# EAGLE schematic PCB_KioskMB_r3.2 (EAGLE 8.2.1)
Assembly variants: 12V_STRIKE, 24V_STRIKE

## Sheet 1 of 7
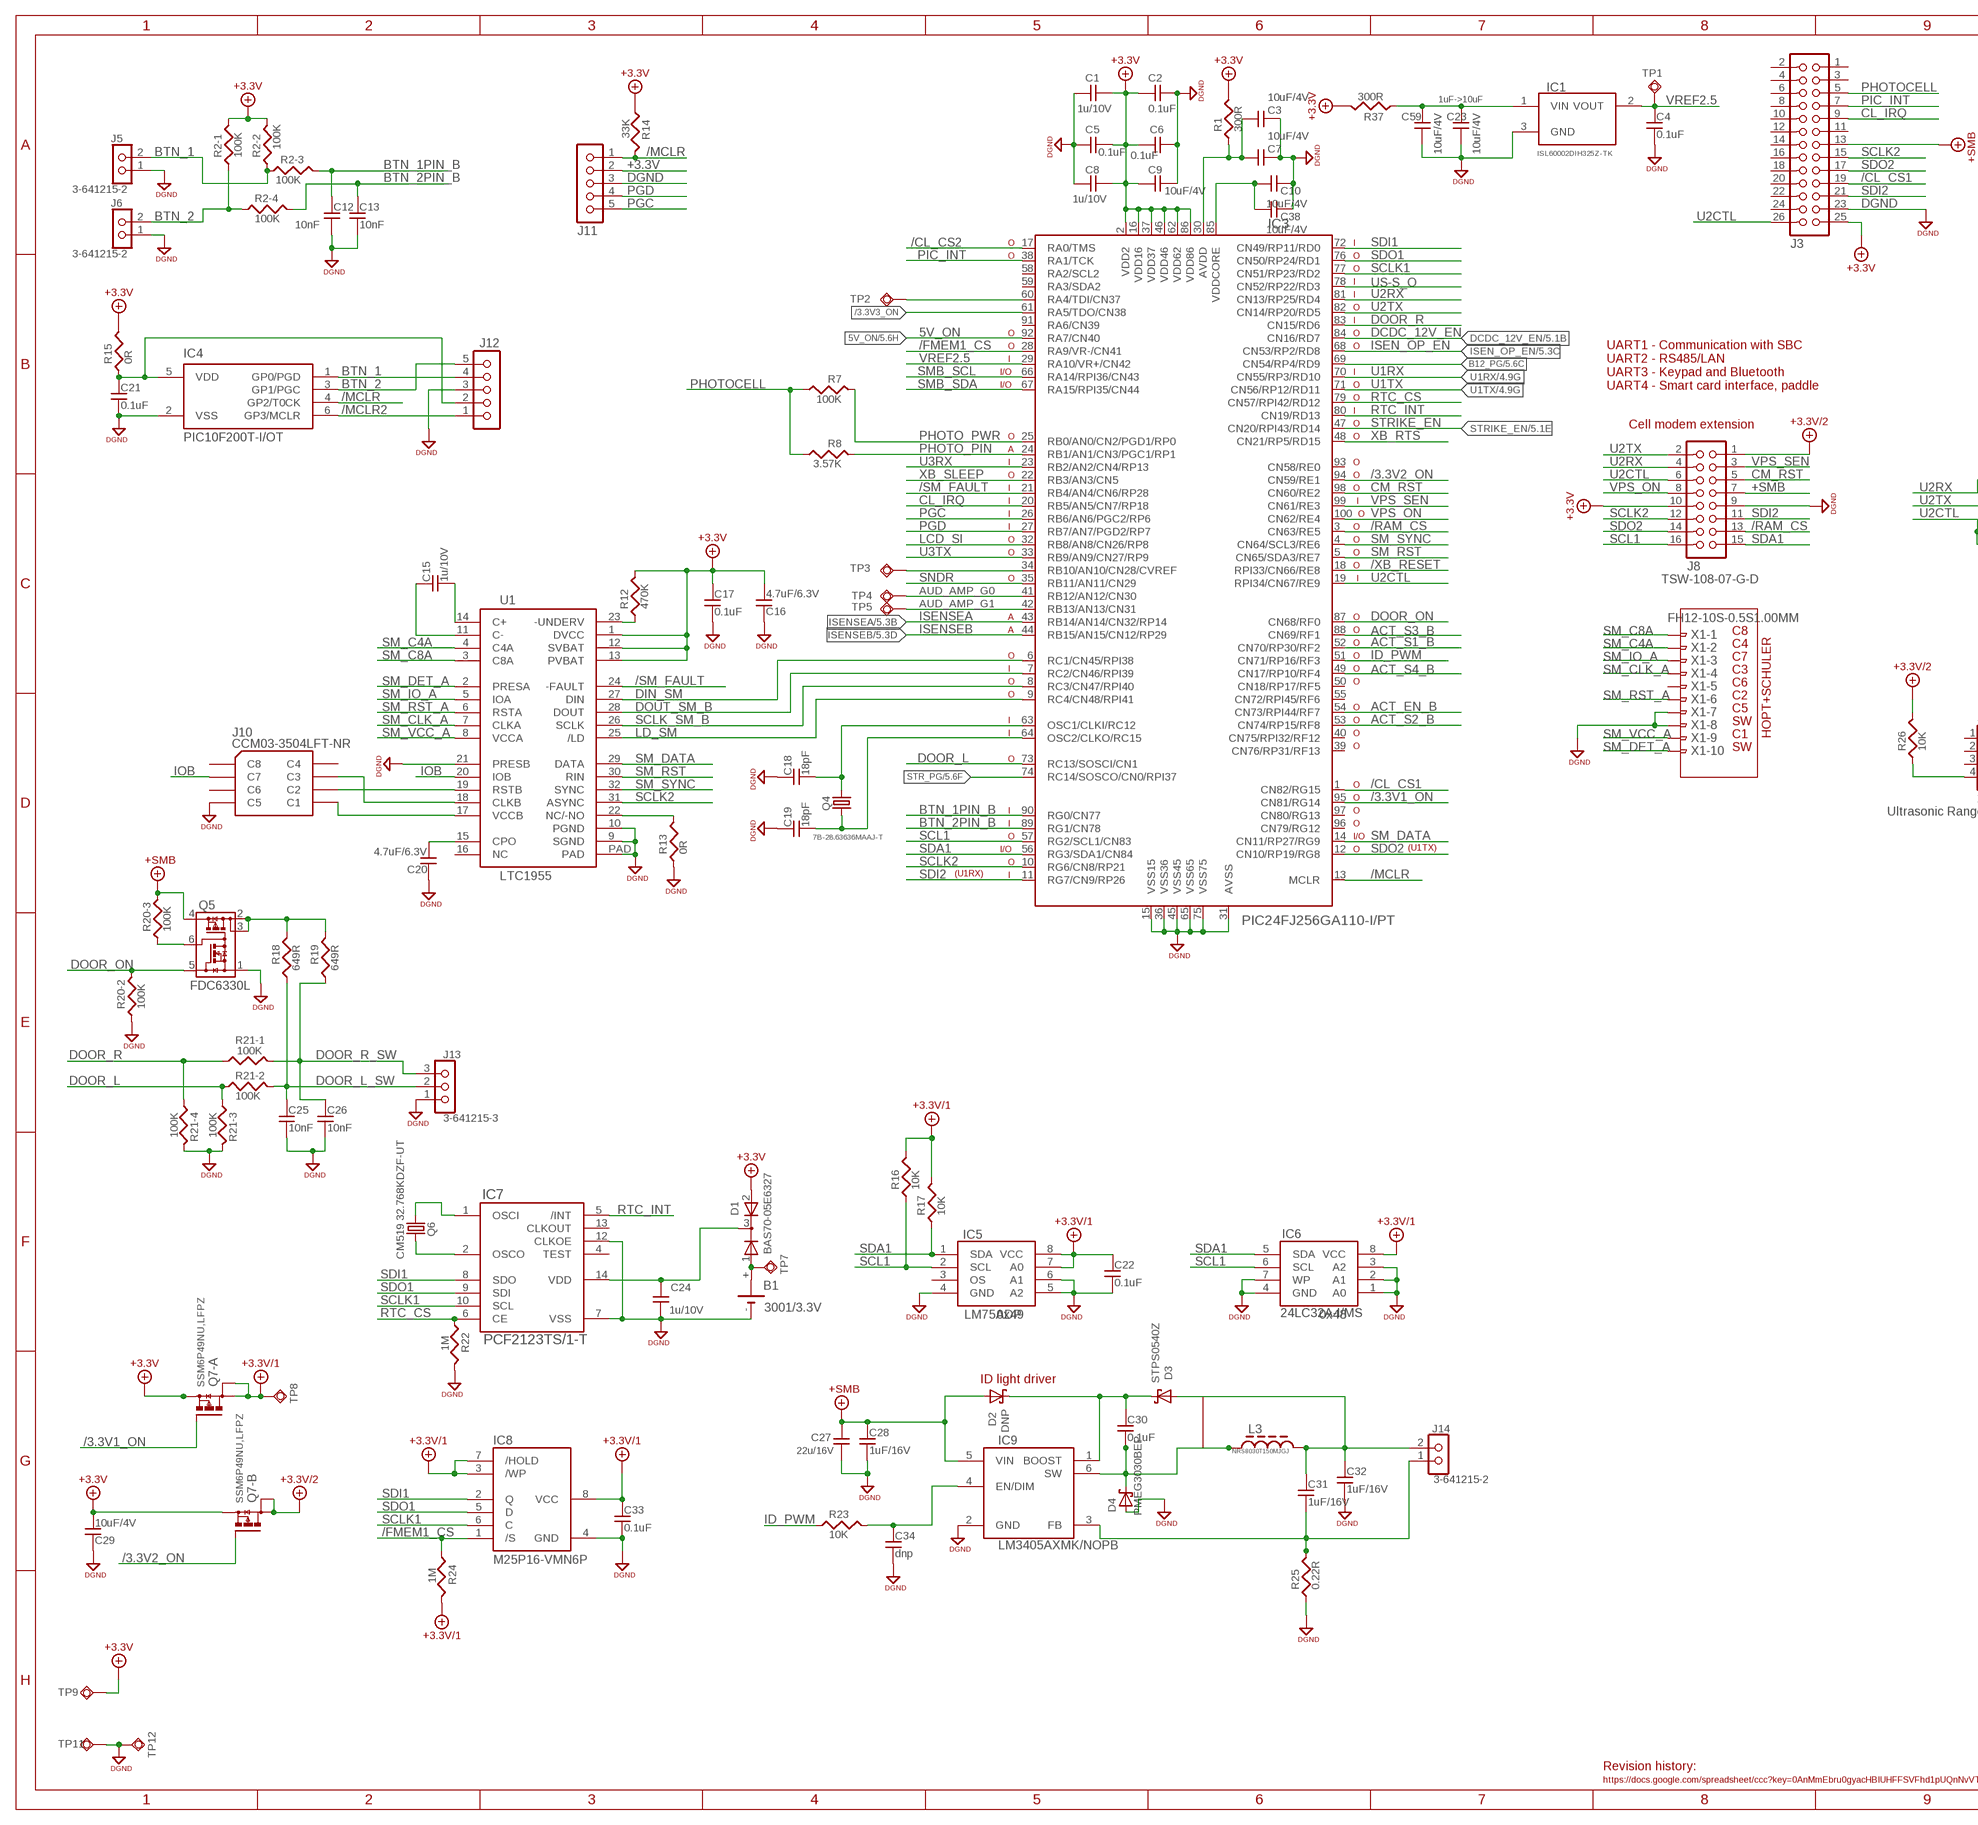
[diagram p0: schematic, sheet 1, part 1 of 2]
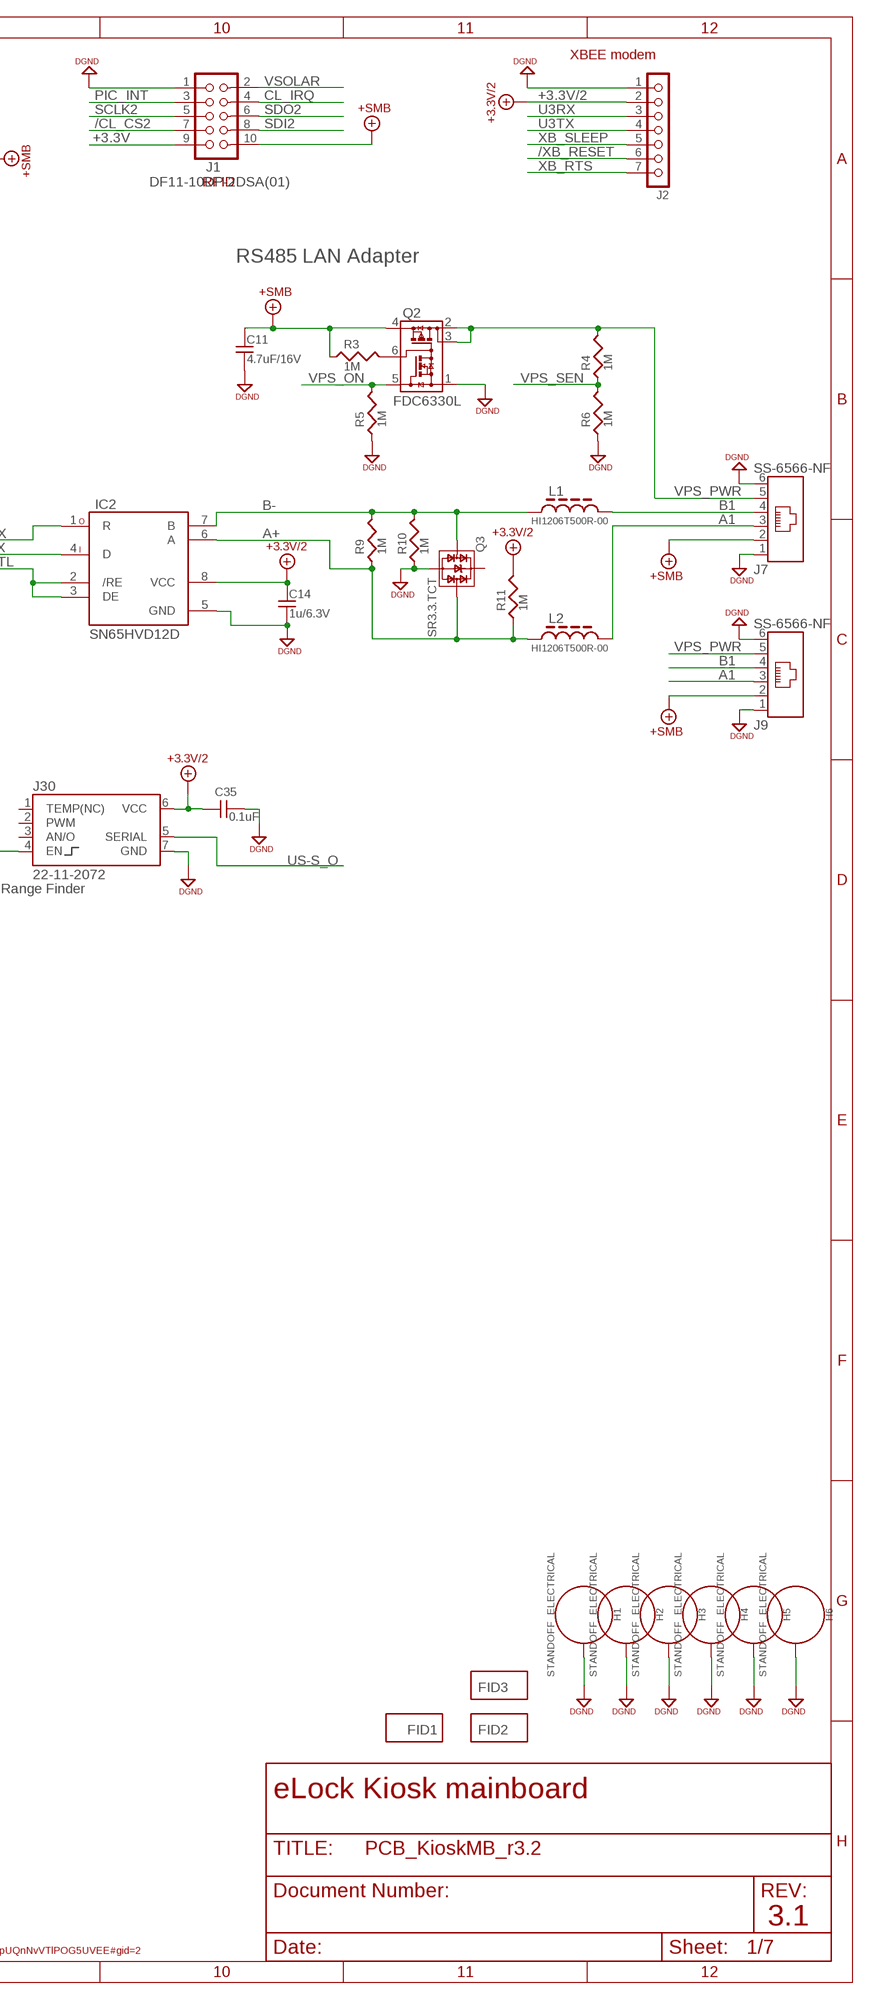
[diagram p1: schematic, sheet 1, part 2 of 2]

### Parts
B1  3001/3.3V  3001  [3001]
C1  1u/10V  C-0603  [0603]
C2  0.1uF  C-0603  [0603]
C3  10uF/4V  C-0603  [0603]
C4  0.1uF  C-0603  [0603]
C5  0.1uF  C-0603  [0603]
C6  0.1uF  C-0603  [0603]
C7  10uF/4V  C-0603  [0603]
C8  1u/10V  C-0603  [0603]
C9  10uF/4V  C-0603  [0603]
C10  10uF/4V  C-0603  [0603]
C11  4.7uF/16V  C-0805  [0805]
C12  10nF  C-0603  [0603]
C13  10nF  C-0603  [0603]
C14  1u/6.3V  C-0603  [0603]
C15  1u/10V  C-0603  [0603]
C16  4.7uF/6.3V  C-0603  [0603]
C17  0.1uF  C-0603  [0603]
C18  18pF  C-0603  [0603]
C19  18pF  C-0603  [0603]
C20  4.7uF/6.3V  C-0603  [0603]
C21  0.1uF  C-0603  [0603]
C22  0.1uF  C-0603  [0603]
C23  10uF/4V  C-0603  [0603]
C24  1u/10V  C-0603  [0603]
C25  10nF  C-0603  [0603]
C26  10nF  C-0603  [0603]
C27  22u/16V  C-1210  [1210]
C28  1uF/16V  C-0603  [0603]
C29  10uF/4V  C-0603  [0603]
C30  0.1uF  C-0603  [0603]
C31  1uF/16V  C-0603  [0603]
C32  1uF/16V  C-0603  [0603]
C33  0.1uF  C-0603  [0603]
C34  dnp  C-0603  [0603]
C35  0.1uF  C-0603  [0603]
C38  10uF/4V  C-0603  [0603]
C59  10uF/4V  C-0603  [0603]
D1  BAS70-05E6327  [SOT-23]
D2  DNP  STPS0540Z  [SOD-123]
D3  STPS0540Z  [SOD-123]
D4  PMEG3030BEP  [SOD-128]
FID1  REF  [REF]
FID2  REF  [REF]
FID3  REF  [REF]
H1  STANDOFF_ELECTRICAL  [STANDOFF-ELECTRICAL]
H2  STANDOFF_ELECTRICAL  [STANDOFF-ELECTRICAL]
H3  STANDOFF_ELECTRICAL  [STANDOFF-ELECTRICAL]
H4  STANDOFF_ELECTRICAL  [STANDOFF-ELECTRICAL]
H5  STANDOFF_ELECTRICAL  [STANDOFF-ELECTRICAL]
H6  STANDOFF_ELECTRICAL  [STANDOFF-ELECTRICAL]
IC1  ISL60002DIH325Z-TK  [SOT-23]
IC2  SN65HVD12D  SN65HVD3082ED  [SO08]
IC3  PIC24FJ256GA110-I/PT  [SQFP-S-12X12-100]
IC4  PIC10F200T-I/OT  [SOT23-6]
IC5  LM75ADP  [TSSOP08-3]
IC6  24LC32A-I/MS  24-I/MS  [MSOP-08]
IC7  PCF2123TS/1-T  [TSSOP014]
IC8  M25P16-VMN6P  [SO-08]
IC9  LM3405AXMK/NOPB  [SOT23-6]
J1  DF11-10DP-2DSA(01)  [DF11-10DP-2DSA]
J2  MA07-1  [MA07-1]
J3  MA13-2  [MA13-2]
J5  3-641215-2  [3-641215-2]
J6  3-641215-2  [3-641215-2]
J7  SS-6566-NF  [SS-6566-NF]
J8  TSW-108-07-G-D  MA08-2  [MA08-2]
J9  SS-6566-NF  [SS-6566-NF]
J10  CCM03-3504LFT-NR  [CCM03-3504LFT-NR]
J11  MA05-1  [MA05-1]
J12  MA05-1  [MA05-1]
J13  3-641215-3  [3-641215-3]
J14  3-641215-2  [3-641215-2]
J30  22-11-2072  HRXL-MAXSONAR-WRC-MB7387  [HRXL-MAXSONAR-WRC-MB7387]
L1  HI1206T500R-00  L-1206  [1206]
L2  HI1206T500R-00  L-1206  [1206]
L3  NRS8030T150MJGJ  [NRS8030]
Q2  FDC6330L  [SSOT-6]
Q3  SR3.3.TCT  SR05.TCT  [SOT-143]
Q4  7B-28.63636MAAJ-T  7B-27.120MAAJ-T  [7B]
Q5  FDC6330L  FDC6324L  [SSOT-6]
Q6  CM519 32.768KDZF-UT  CM519  [CM519]
Q7  SSM6P49NU,LFPZ  [MICRO_FET]
R1  300R  R-0603  [0603]
R2  100K  EXB-38  [0603-ARRAY]
R3  1M  R-0603  [0603]
R4  1M  R-0603  [0603]
R5  1M  R-0603  [0603]
R6  1M  R-0603  [0603]
R7  100K  R-0603  [0603]
R8  3.57K  R-0603  [0603]
R9  1M  R-0603  [0603]
R10  1M  R-0603  [0603]
R11  1M  R-0603  [0603]
R12  470K  R-0603-0RTOP  [0603-0RTOP]
R13  0R  R-0603-0RTOP  [0603-0RTOP]
R14  33K  R-0603  [0603]
R15  0R  R-0603-0RTOP  [0603-0RTOP]
R16  10K  R-0603-0RTOP  [0603-0RTOP]
R17  10K  R-0603-0RTOP  [0603-0RTOP]
R18  649R  R-0603  [0603]
R19  649R  R-0603  [0603]
R20  100K  EXB-38  [0603-ARRAY]
R21  100K  EXB-38  [0603-ARRAY]
R22  1M  R-0603  [0603]
R23  10K  R-0603-0RTOP  [0603-0RTOP]
R24  1M  R-0603  [0603]
R25  0.22R  R-0603-0RTOP  [0603-0RTOP]
R26  10K  R-0603-0RTOP  [0603-0RTOP]
R37  300R  R-0603  [0603]
TP1  ROUND_SMD1MM  [SMD_ROUND_1MM]
TP2  ROUND_SMD1MM  [SMD_ROUND_1MM]
TP3  ROUND_SMD1MM  [SMD_ROUND_1MM]
TP4  ROUND_SMD1MM  [SMD_ROUND_1MM]
TP5  ROUND_SMD1MM  [SMD_ROUND_1MM]
TP7  ROUND_SMD1MM  [SMD_ROUND_1MM]
TP8  ROUND_SMD1MM  [SMD_ROUND_1MM]
TP9  ROUND_SMD0.7MM  [SMD_ROUND_07MM]
TP11  ROUND_SMD0.7MM  [SMD_ROUND_07MM]
TP12  TP_0812  [TP_0.8_1.2]
U1  LTC1955  [LFCSP_5X5_032]
X1  FH12-10S-0.5S1.00MM  [CON-FPC-1.0MM-10POS]

### Nets
5V_ON: IC3.92(RA7/CN40) ; also sheet 5
+3.3V: C1.1 C2.1 C5.1 C6.1 C8.1 C9.1 C16.2 C17.1 C29.2 D1.2(A2) IC3.2(VDD2) IC3.16(VDD16) IC3.37(VDD37) IC3.46(VDD46) IC3.62(VDD62) IC3.86(VDD86) J1.9 J3.25 J8.10 J11.2 Q7.1(-A:S) Q7.4(-B:S) R1.2 R2.7 R2.8 R12.2 R14.2 R15.2 R37.2 TP9.P$1(TP) U1.1(DVCC) U1.12(SVBAT) U1.13(PVBAT) ; also sheet 5
+3.3V/1: C22.1 C33.1 IC5.7(A0) IC5.8(VCC) IC6.8(VCC) IC8.3(/WP) IC8.7(/HOLD) IC8.8(VCC) Q7.6(-A:D) Q7.P1(-A:D1) R16.2 R17.2 R24.1 TP8.P$1(TP) ; also sheet 2,6
+3.3V/2: C14.1 C35.2 IC2.8(VCC) J2.2 J8.1 J30.6(VCC) Q7.3(-B:D) Q7.P2(-B:D1) R11.2 R26.2
+SMB: C11.1 C27.1 C28.1 D2.A IC9.5(VIN) J1.10 J3.13 J7.2 J8.7 J9.2 Q2.4(Q2S) Q5.4(Q2S) R3.1 R20.6 ; also sheet 5
/3.3V1_ON: IC3.95(CN81/RG14) Q7.2(-A:G)
/3.3V2_ON: IC3.94(CN59/RE1) Q7.5(-B:G)
/3.3V3_ON: IC3.61(RA5/TDO/CN38)
/CL_CS1: IC3.1(CN82/RG15) J3.19
/CL_CS2: IC3.17(RA0/TMS) J1.7
/FMEM1_CS: IC3.28(RA9/VR-/CN41) IC8.1(/S) R24.2
/MCLR: IC3.13(MCLR) IC4.4(GP2/T0CK) J11.1 R14.1
/MCLR2: IC4.6(GP3/MCLR) J12.1
/RAM_CS: IC3.3(CN63/RE5) J8.13
/SM_FAULT: IC3.21(RB4/AN4/CN6/RP28) U1.24(-FAULT)
/XB_RESET: IC3.18(RPI33/CN66/RE8) J2.6
A1: J7.3 J9.3 L2.2
A+: IC2.6(A) L2.1 Q3.3 R9.1 R11.1
ACT_EN_B: IC3.54(CN73/RPI44/RF7)
ACT_S1_B: IC3.52(CN70/RP30/RF2) ; also sheet 5
ACT_S2_B: IC3.53(CN74/RP15/RF8) ; also sheet 5
ACT_S3_B: IC3.88(CN69/RF1)
ACT_S4_B: IC3.49(CN17/RP10/RF4)
AUD_AMP_G0: IC3.41(RB12/AN12/CN30) TP4.P$1(TP) ; also sheet 6
AUD_AMP_G1: IC3.42(RB13/AN13/CN31) TP5.P$1(TP) ; also sheet 6
B1: J7.4 J9.4 L1.2
B12_PG: IC3.69(CN54/RP4/RD9) ; also sheet 5
B-: IC2.7(B) L1.1 Q3.2 R9.2 R10.2
BTN_1: IC4.1(GP0/PGD) J5.2 J12.4 R2.2 R2.3
BTN_1PIN_B: C12.1 IC3.90(RG0/CN77) R2.6
BTN_2: IC4.3(GP1/PGC) J6.2 J12.5 R2.1 R2.4
BTN_2PIN_B: C13.1 IC3.89(RG1/CN78) R2.5
CL_IRQ: IC3.20(RB5/AN5/CN7/RP18) J1.4 J3.9
CM_RST: IC3.98(CN60/RE2) J8.5
DCDC_12V_EN: IC3.84(CN16/RD7) ; also sheet 5
DGND: B1.- C1.2 C2.2 C3.2 C4.2 C5.2 C6.2 C7.2 C8.2 C9.2 C10.1 C11.2 C12.2 C13.2 C14.2 C16.1 C17.2 C18.1 C19.1 C20.1 C21.2 C22.2 C23.2 C24.2 C25.2 C26.2 C27.2 C28.2 C29.1 C32.2 C33.2 C34.2 C35.1 C38.1 C59.2 D4.A H1.P1 H2.P1 H3.P1 H4.P1 H5.P1 IC1.3(GND) IC2.5(GND) IC3.15(VSS15) IC3.31(AVSS) IC3.36(VSS36) IC3.45(VSS45) IC3.65(VSS65) IC3.75(VSS75) IC4.2(VSS) IC5.4(GND) IC5.5(A2) IC5.6(A1) IC6.1(A0) IC6.2(A1) IC6.3(A2) IC6.4(GND) IC6.7(WP) IC7.7(VSS) IC7.12(CLKOE) IC8.4(GND) IC9.2(GND) J1.1 J2.1 J3.23 J5.1 J6.1 J7.1 J7.6 J8.9 J9.1 J9.6 J10.C5 J11.3 J12.3 J13.1 J30.7(GND) Q2.1(Q1S) Q3.1 Q5.1(Q1S) R5.1 R6.1 R10.1 R13.1 R20.2 R21.5 R21.6 R22.1 R25.1 TP11.P$1(TP) TP12.1(TP) U1.9(SGND) U1.10(PGND) U1.21(PRESB) U1.PAD X1.7 X1.8 ; also sheet 2,4,5,6
DIN_SM: IC3.6(RC1/CN45/RPI38) U1.27(DIN)
DOOR_L: IC3.73(RC13/SOSCI/CN1) R21.2 R21.3
DOOR_L_SW: C25.1 J13.2 R18.2 R21.7
DOOR_ON: IC3.87(CN68/RF0) Q5.5(Q1G) R20.7
DOOR_R: IC3.83(CN15/RD6) R21.1 R21.4
DOOR_R_SW: C26.1 J13.3 R19.2 R21.8
DOUT_SM_B: IC3.7(RC2/CN46/RPI39) U1.28(DOUT)
ID_PWM: IC3.51(CN71/RP16/RF3) R23.1
IOB: J10.C7 U1.20(IOB)
ISEN_OP_EN: IC3.68(CN53/RP2/RD8) ; also sheet 5
ISENSEA: IC3.43(RB14/AN14/CN32/RP14) ; also sheet 5
ISENSEB: IC3.44(RB15/AN15/CN12/RP29) ; also sheet 5
LCD_SI: IC3.32(RB8/AN8/CN26/RP8)
LD_SM: IC3.9(RC4/CN48/RPI41) U1.25(/LD)
N$1: C10.2 C38.2 IC3.85(VDDCORE)
N$2: C20.2 U1.15(CPO)
N$3: B1.+ D1.1(A1) TP7.P$1(TP)
N$7: J10.C2 U1.19(RSTB)
N$8: C19.2 IC3.64(OSC2/CLKO/RC15) Q4.1
N$9: J30.4(EN) R26.1
N$13: C15.1 U1.11(C-)
N$14: C15.2 U1.14(C+)
N$16: C24.1 D1.3(K) IC7.14(VDD)
N$18: R12.1 U1.23(-UNDERV)
N$22: IC7.1(OSCI) Q6.2
N$23: IC7.2(OSCO) Q6.1
N$25: R13.2 U1.22(NC/-NO)
N$28: J10.C3 U1.18(CLKB)
N$34: J10.C1 U1.17(VCCB)
N$35: Q5.6(Q2G) R20.3
N$36: C18.2 IC3.63(OSC1/CLKI/RC12) Q4.3
N$39: C23.1 C59.1 IC1.1(VIN) R37.1
N$40: Q5.2(Q2D1) Q5.3(Q2D2) R18.1 R19.1
N$43: C21.1 IC4.5(VDD) J12.2 R15.1
N$44: IC3.34(RB10/AN10/CN28/CVREF) TP3.P$1(TP)
N$49: C3.1 C7.1 IC3.30(AVDD) R1.1
N$55: IC3.60(RA4/TDI/CN37) TP2.P$1(TP)
N$63: C34.1 IC9.4(EN/DIM) R23.2
N$64: C30.2 D4.K IC9.6(SW) L3.1
N$65: C31.2 IC9.3(FB) J14.1 R25.2
N$66: C30.1 D2.C(K) D3.C(K) IC9.1(BOOST)
N$67: C31.1 C32.1 D3.A J14.2 L3.2
N$99: Q2.6(Q2G) R3.2
PGC: IC3.26(RB6/AN6/PGC2/RP6) J11.5
PGD: IC3.27(RB7/AN7/PGD2/RP7) J11.4
PHOTO_PIN: IC3.24(RB1/AN1/CN3/PGC1/RP1) R8.1
PHOTO_PWR: IC3.25(RB0/AN0/CN2/PGD1/RP0) R7.1
PHOTOCELL: J3.5 R7.2 R8.2
PIC_INT: IC3.38(RA1/TCK) J1.3 J3.7
RTC_CS: IC3.79(CN57/RPI42/RD12) IC7.6(CE) R22.2
RTC_INT: IC3.80(CN19/RD13) IC7.5(/INT)
SCL1: IC3.57(RG2/SCL1/CN83) IC5.2(SCL) IC6.6(SCL) J8.16 R16.1 ; also sheet 2
SCLK1: IC3.77(CN51/RP23/RD2) IC7.10(SCL) IC8.6(C)
SCLK2: IC3.10(RG6/CN8/RP21) J1.5 J3.15 J8.12 U1.31(ASYNC)
SCLK_SM_B: IC3.8(RC3/CN47/RPI40) U1.26(SCLK)
SDA1: IC3.56(RG3/SDA1/CN84) IC5.1(SDA) IC6.5(SDA) J8.15 R17.1 ; also sheet 2
SDI1: IC3.72(CN49/RP11/RD0) IC7.8(SDO) IC8.2(Q)
SDI2: IC3.11(RG7/CN9/RP26) J1.8 J3.21 J8.11
SDO1: IC3.76(CN50/RP24/RD1) IC7.9(SDI) IC8.5(D)
SDO2: IC3.12(CN10/RP19/RG8) J1.6 J3.17 J8.14
SM_C4A: U1.4(C4A) X1.2
SM_C8A: U1.3(C8A) X1.1
SM_CLK_A: U1.7(CLKA) X1.4
SM_DATA: IC3.14(CN11/RP27/RG9) U1.29(DATA)
SM_DET_A: U1.2(PRESA) X1.10
SM_IO_A: U1.5(IOA) X1.3
SM_RST: IC3.5(CN65/SDA3/RE7) U1.30(RIN)
SM_RST_A: U1.6(RSTA) X1.6
SM_SYNC: IC3.4(CN64/SCL3/RE6) U1.32(SYNC)
SM_VCC_A: U1.8(VCCA) X1.9
SMB_SCL: IC3.66(RA14/RPI36/CN43) ; also sheet 5
SMB_SDA: IC3.67(RA15/RPI35/CN44) ; also sheet 5
SNDR: IC3.35(RB11/AN11/CN29)
STR_PG: IC3.74(RC14/SOSCO/CN0/RPI37) ; also sheet 5
STRIKE_EN: IC3.47(CN20/RPI43/RD14) ; also sheet 5
U1RX: IC3.70(CN55/RP3/RD10) ; also sheet 4
U1TX: IC3.71(CN56/RP12/RD11) ; also sheet 4
U2CTL: IC2.2(/RE) IC2.3(DE) IC3.19(RPI34/CN67/RE9) J3.26 J8.6
U2RX: IC2.1(R) IC3.81(CN13/RP25/RD4) J8.4
U2TX: IC2.4(D) IC3.82(CN14/RP20/RD5) J8.2
U3RX: IC3.23(RB2/AN2/CN4/RP13) J2.3
U3TX: IC3.33(RB9/AN9/CN27/RP9) J2.4
US-S_O: IC3.78(CN52/RP22/RD3) J30.5(SERIAL)
VPS_ON: IC3.100(CN62/RE4) J8.8 Q2.5(Q1G) R5.2
VPS_PWR: J7.5 J9.5 Q2.2(Q2D1) Q2.3(Q2D2) R4.2
VPS_SEN: IC3.99(CN61/RE3) J8.3 R4.1 R6.2
VREF2.5: C4.1 IC1.2(VOUT) IC3.29(RA10/VR+/CN42) TP1.P$1(TP)
VSOLAR: J1.2
XB_RTS: IC3.48(CN21/RP5/RD15) J2.7
XB_SLEEP: IC3.22(RB3/AN3/CN5) J2.5
Unconnected: B1.+2(+) H6.P1 IC3.39(CN76/RP31/RF13) IC3.40(CN75/RPI32/RF12) IC3.50(CN18/RP17/RF5) IC3.55(CN72/RPI45/RF6) IC3.58(RA2/SCL2) IC3.59(RA3/SDA2) IC3.91(RA6/CN39) IC3.93(CN58/RE0) IC3.96(CN79/RG12) IC3.97(CN80/RG13) IC5.3(OS) IC7.4(TEST) IC7.13(CLKOUT) J3.1 J3.2 J3.3 J3.4 J3.6 J3.8 J3.10 J3.11 J3.12 J3.14 J3.16 J3.18 J3.20 J3.22 J3.24 J10.C4 J10.C6 J10.C8 J30.1(TEMP(NC)) J30.2(PWM) J30.3(AN/O) Q3.4 R20.1 R20.4 R20.5 R20.8 U1.16(NC) X1.5

### Notes on the sheet
- XBEE modem
- 1uF->10uF
- RFID
- RS485 LAN Adapter
- O | I
- O | O
- O
- I
- I
- O
- I
- O | O
- O | O
- I
- I/O | I
- I/O | O
- UART1 - Communication with SBC
   UART2 - RS485/LAN 
   UART3 - Keypad and Bluetooth
   UART4 - Smart card interface, paddle
- O
- I
- O | Cell modem extension
- O | O
- A
- I | O
- O | O | O
- I | O
- I | I | I
- I | O
- I | O
- O | O
- O | O
- O
- O | I
- A | O
- A | O | C8
- O | C4
- O | O | C7
- I | O | C3
- O | O | C6
- O | C2
- O | C5
- I | O | SW
- I | O | C1 | HOPT+SCHULER
- O | SW
- O
- O
- O
- I | O | Ultrasonic Range Finder
- I | O
- O | I/O
- I/O | O | (U1TX)
- O
- (U1RX) | I
- 0x49 | 0x48
- ID light driver
- eLock Kiosk mainboard
- 3.1
- Revision history:
- https://docs.google.com/spreadsheet/ccc?key=0AnMmEbru0gyacHBIUHFFSVFhd1pUQnNvVTlPOG5UVEE#gid=2

## Sheet 2 of 7
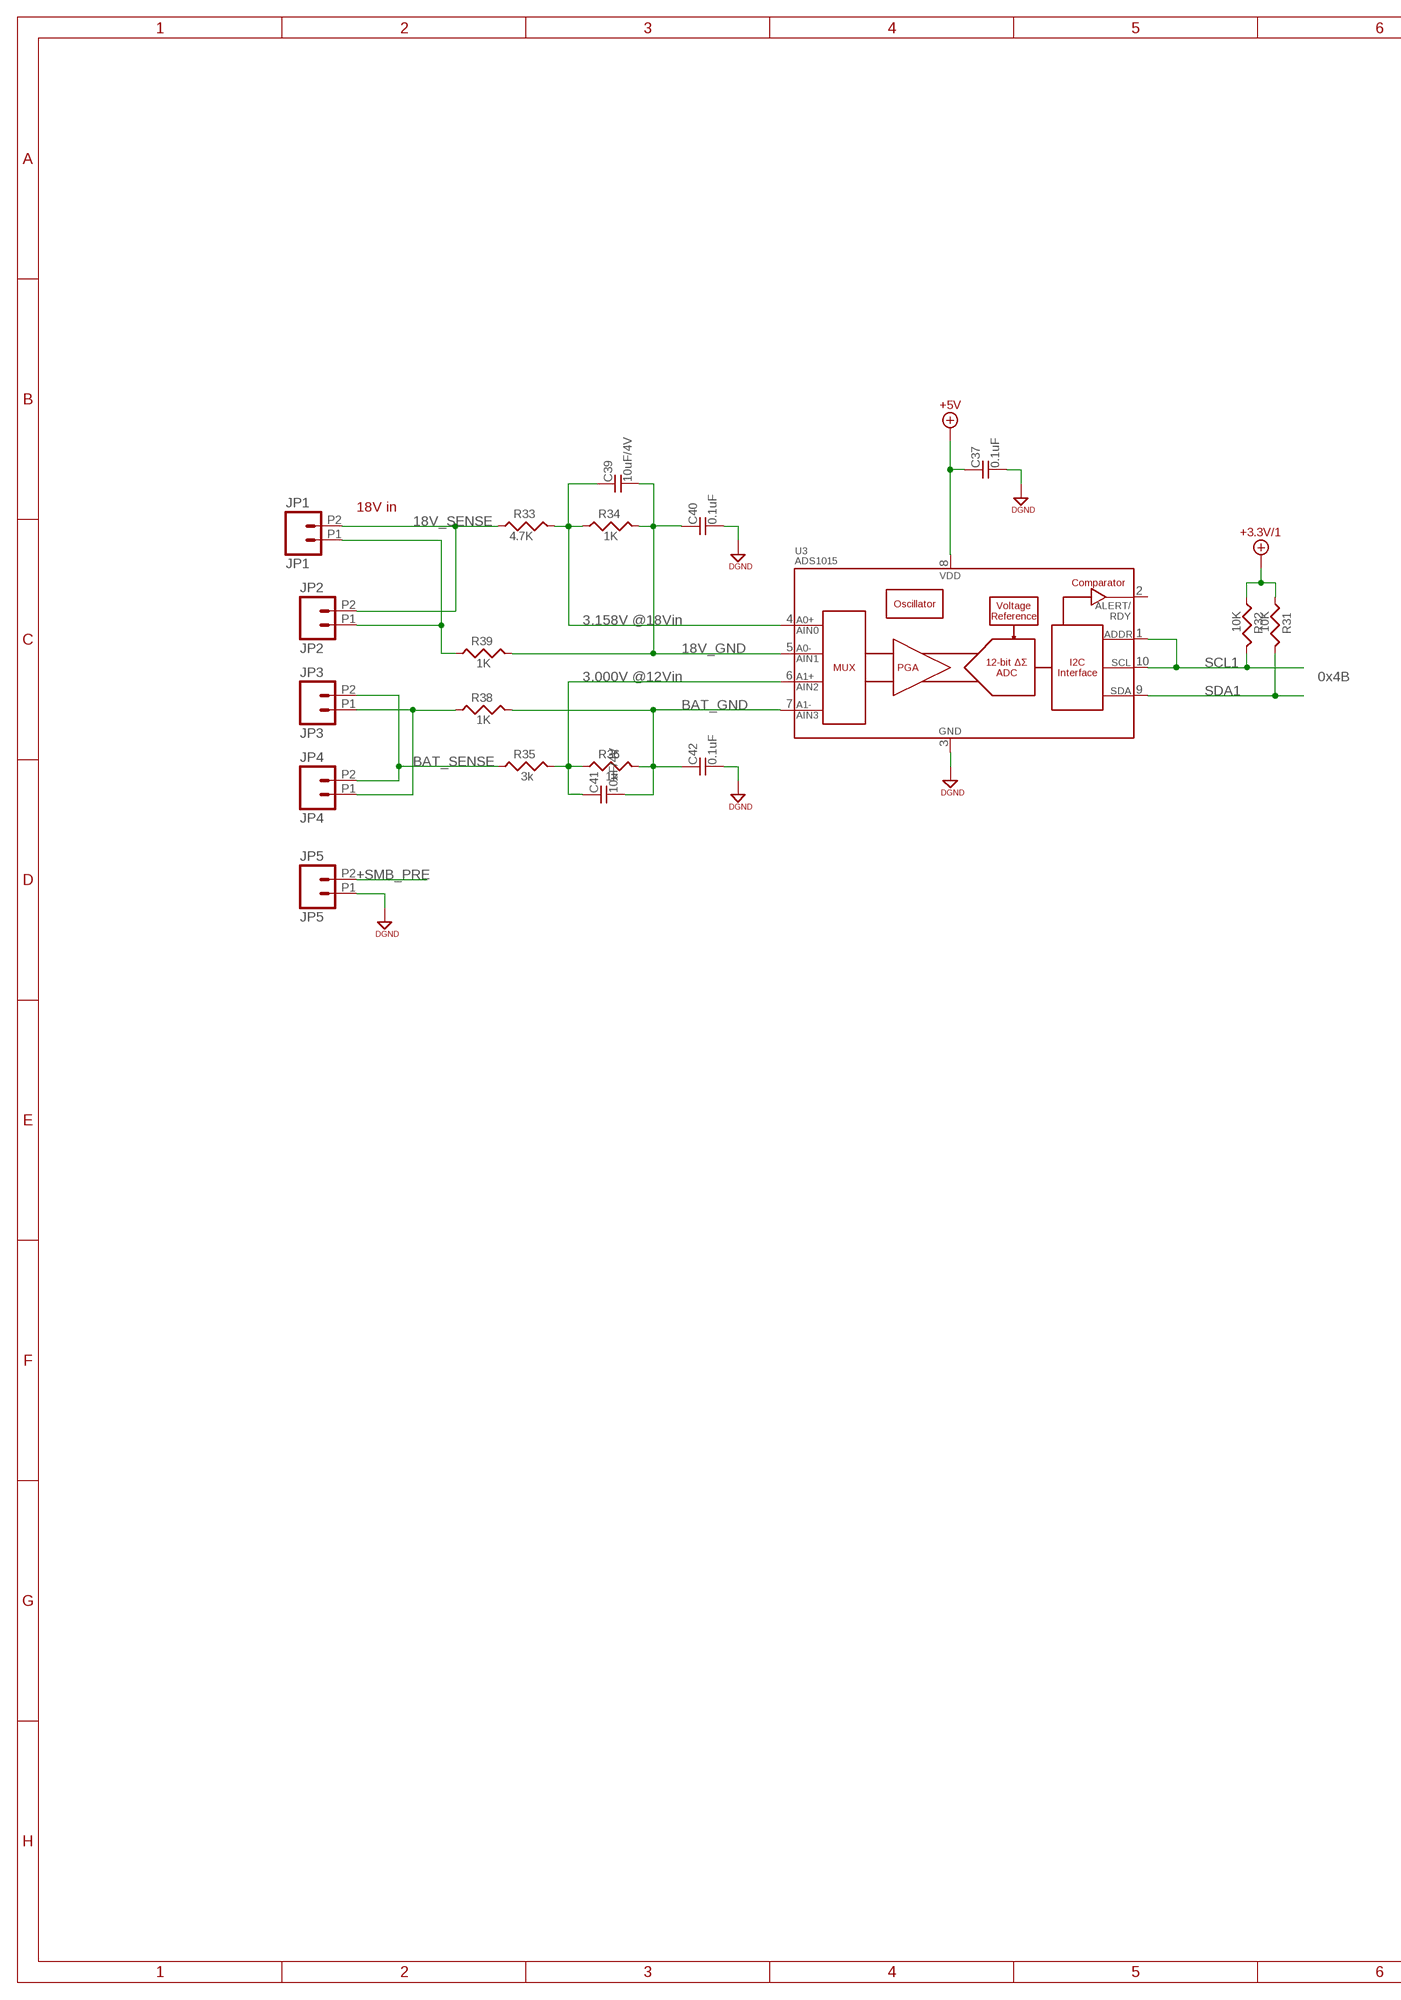
[diagram p2: schematic, sheet 2, part 1 of 2]
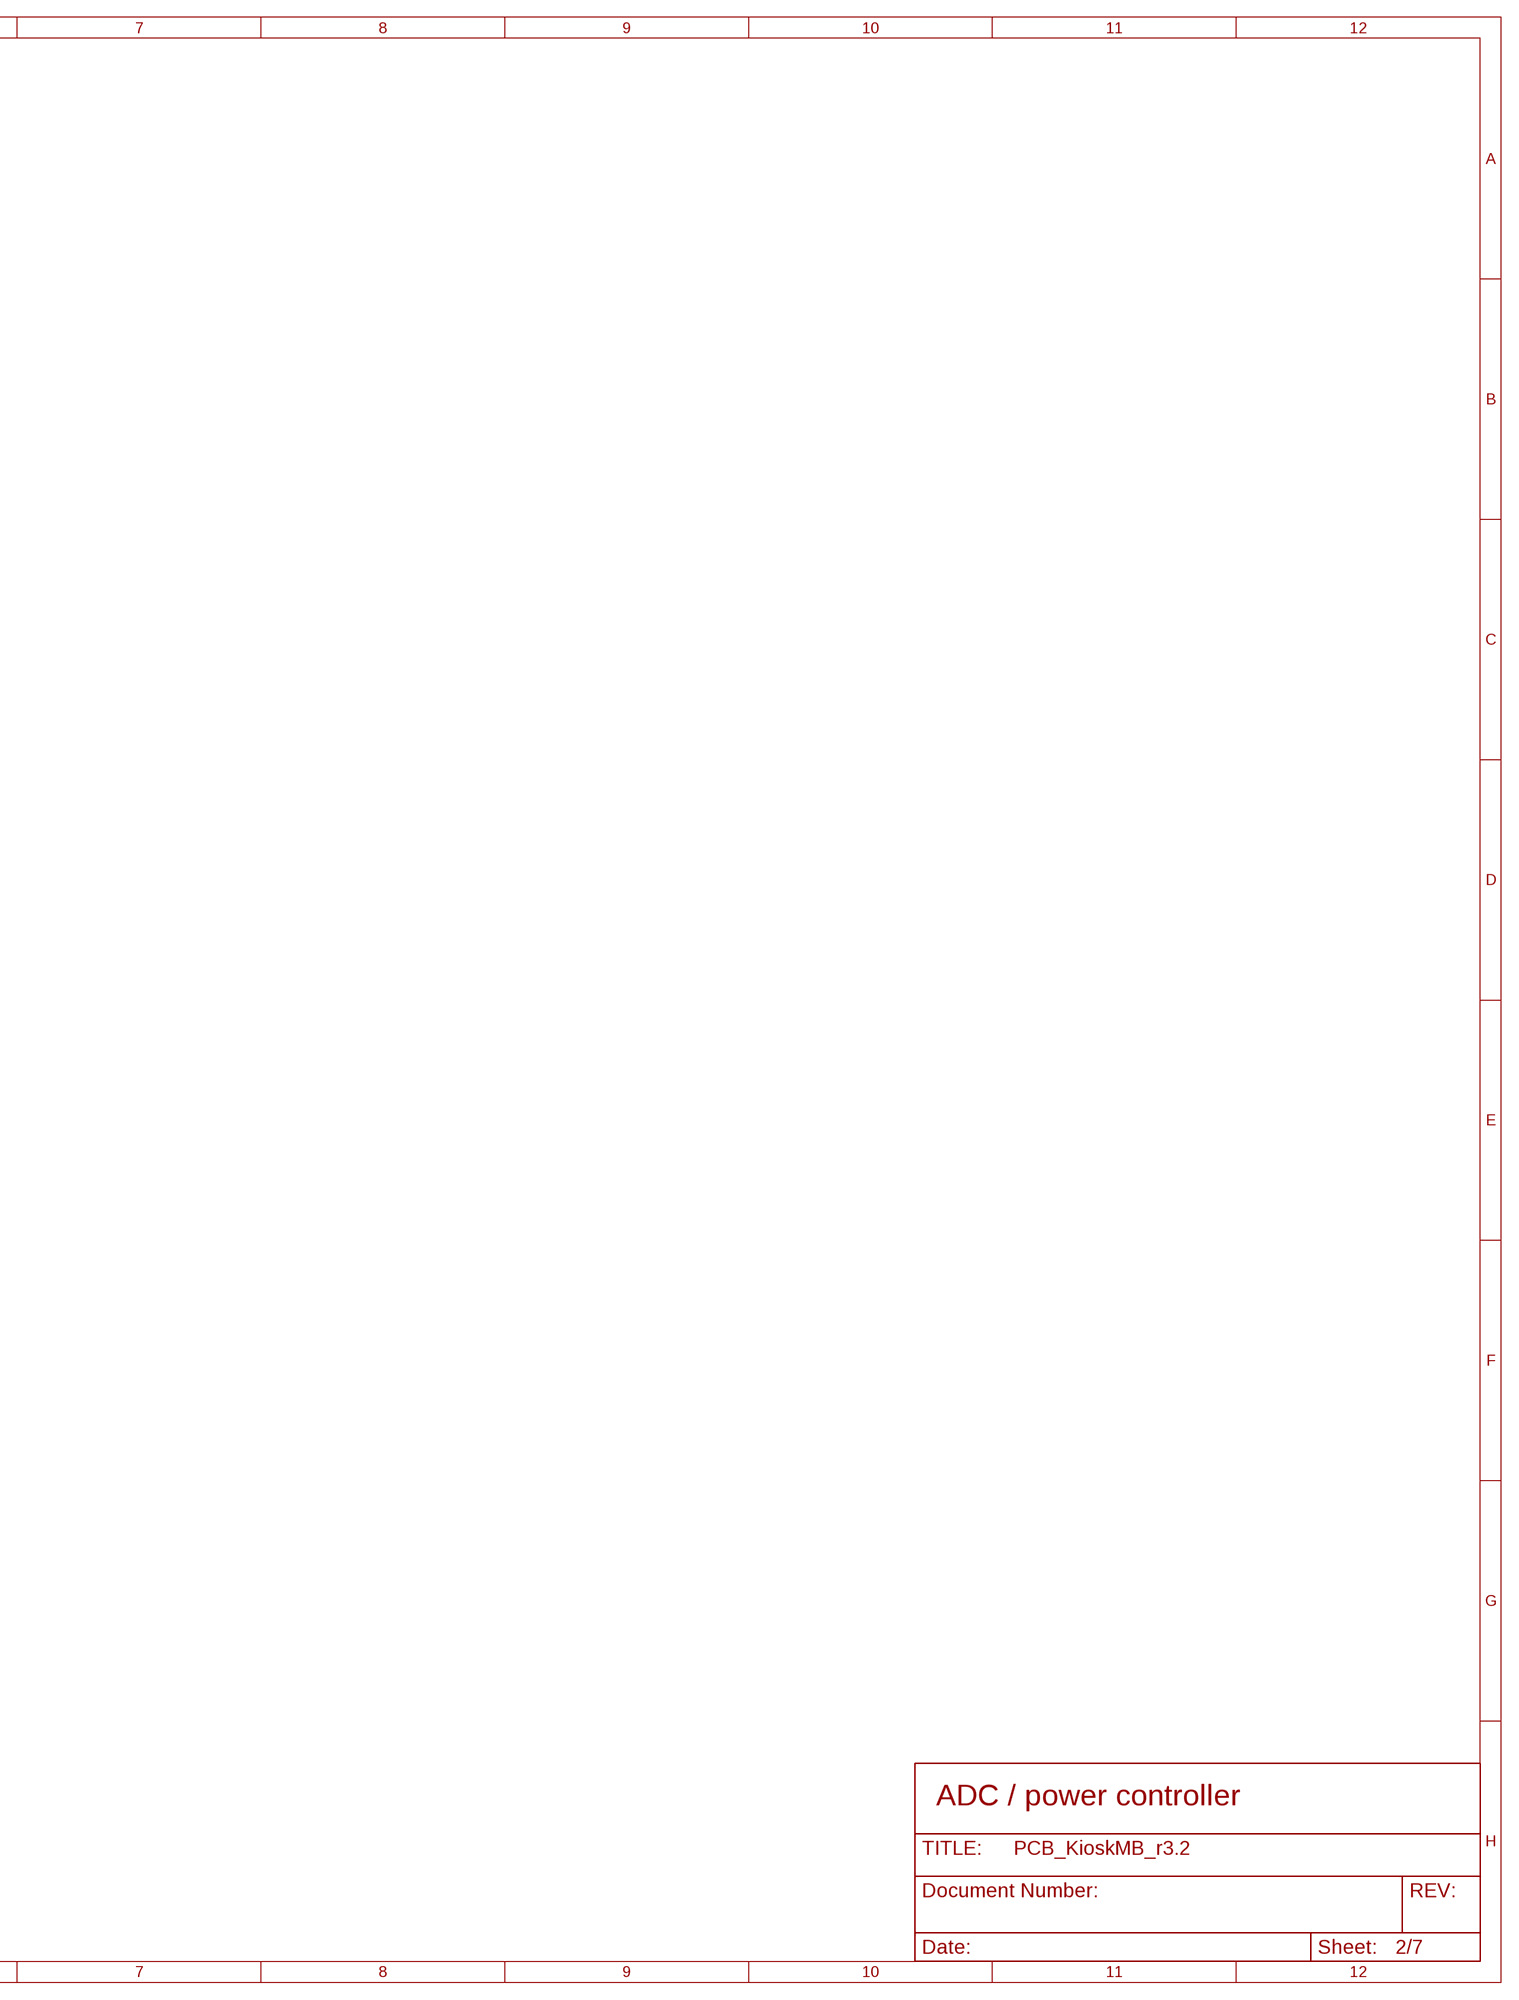
[diagram p3: schematic, sheet 2, part 2 of 2]

### Parts
C37  0.1uF  C-0603  [0603]
C39  10uF/4V  C-0603  [0603]
C40  0.1uF  C-0603  [0603]
C41  10uF/4V  C-0603  [0603]
C42  0.1uF  C-0603  [0603]
JP1  M022.54MM_SCREWTERM  [1X02_2.54_SCREWTERM]
JP2  M022.54MM_SCREWTERM  [1X02_2.54_SCREWTERM]
JP3  M022.54MM_SCREWTERM  [1X02_2.54_SCREWTERM]
JP4  M022.54MM_SCREWTERM  [1X02_2.54_SCREWTERM]
JP5  M022.54MM_SCREWTERM  [1X02_2.54_SCREWTERM]
R31  10K  R-0603  [0603]
R32  10K  R-0603  [0603]
R33  4.7K  R-0603  [0603]
R34  1K  R-0603  [0603]
R35  3k  R-0603  [0603]
R36  1k  R-0603  [0603]
R38  1K  R-0603  [0603]
R39  1K  R-0603  [0603]
U3  ADS1015  [MSOP10]

### Nets
18V_GND: C39.2 C40.1 R34.1 R39.1 U3.5(AIN1)
18V_SENSE: JP1.P2 JP2.P2 R33.2
+3.3V/1: R31.2 R32.2 ; also sheet 1,6
+5V: C37.1 U3.8(VDD) ; also sheet 5
+SMB_PRE: JP5.P2 ; also sheet 5
BAT_GND: C41.2 C42.1 R36.1 R38.1 U3.7(AIN3)
BAT_SENSE: JP3.P2 JP4.P2 R35.2
DGND: C37.2 C40.2 C42.2 JP5.P1 U3.3(VSS) ; also sheet 1,4,5,6
N$5: JP3.P1 JP4.P1 R38.2
N$19: C39.1 R33.1 R34.2 U3.4(AIN0)
N$21: C41.1 R35.1 R36.2 U3.6(AIN2)
N$41: JP1.P1 JP2.P1 R39.2
SCL1: R32.1 U3.1(ADDR) U3.10(SCL) ; also sheet 1
SDA1: R31.1 U3.9(SDA) ; also sheet 1
Unconnected: U3.2(ALERT/RDY)

### Notes on the sheet
- 18V in
- 3.158V @18Vin
- 3.000V @12Vin | 0x4B
- ADC / power controller

## Sheet 3 of 7
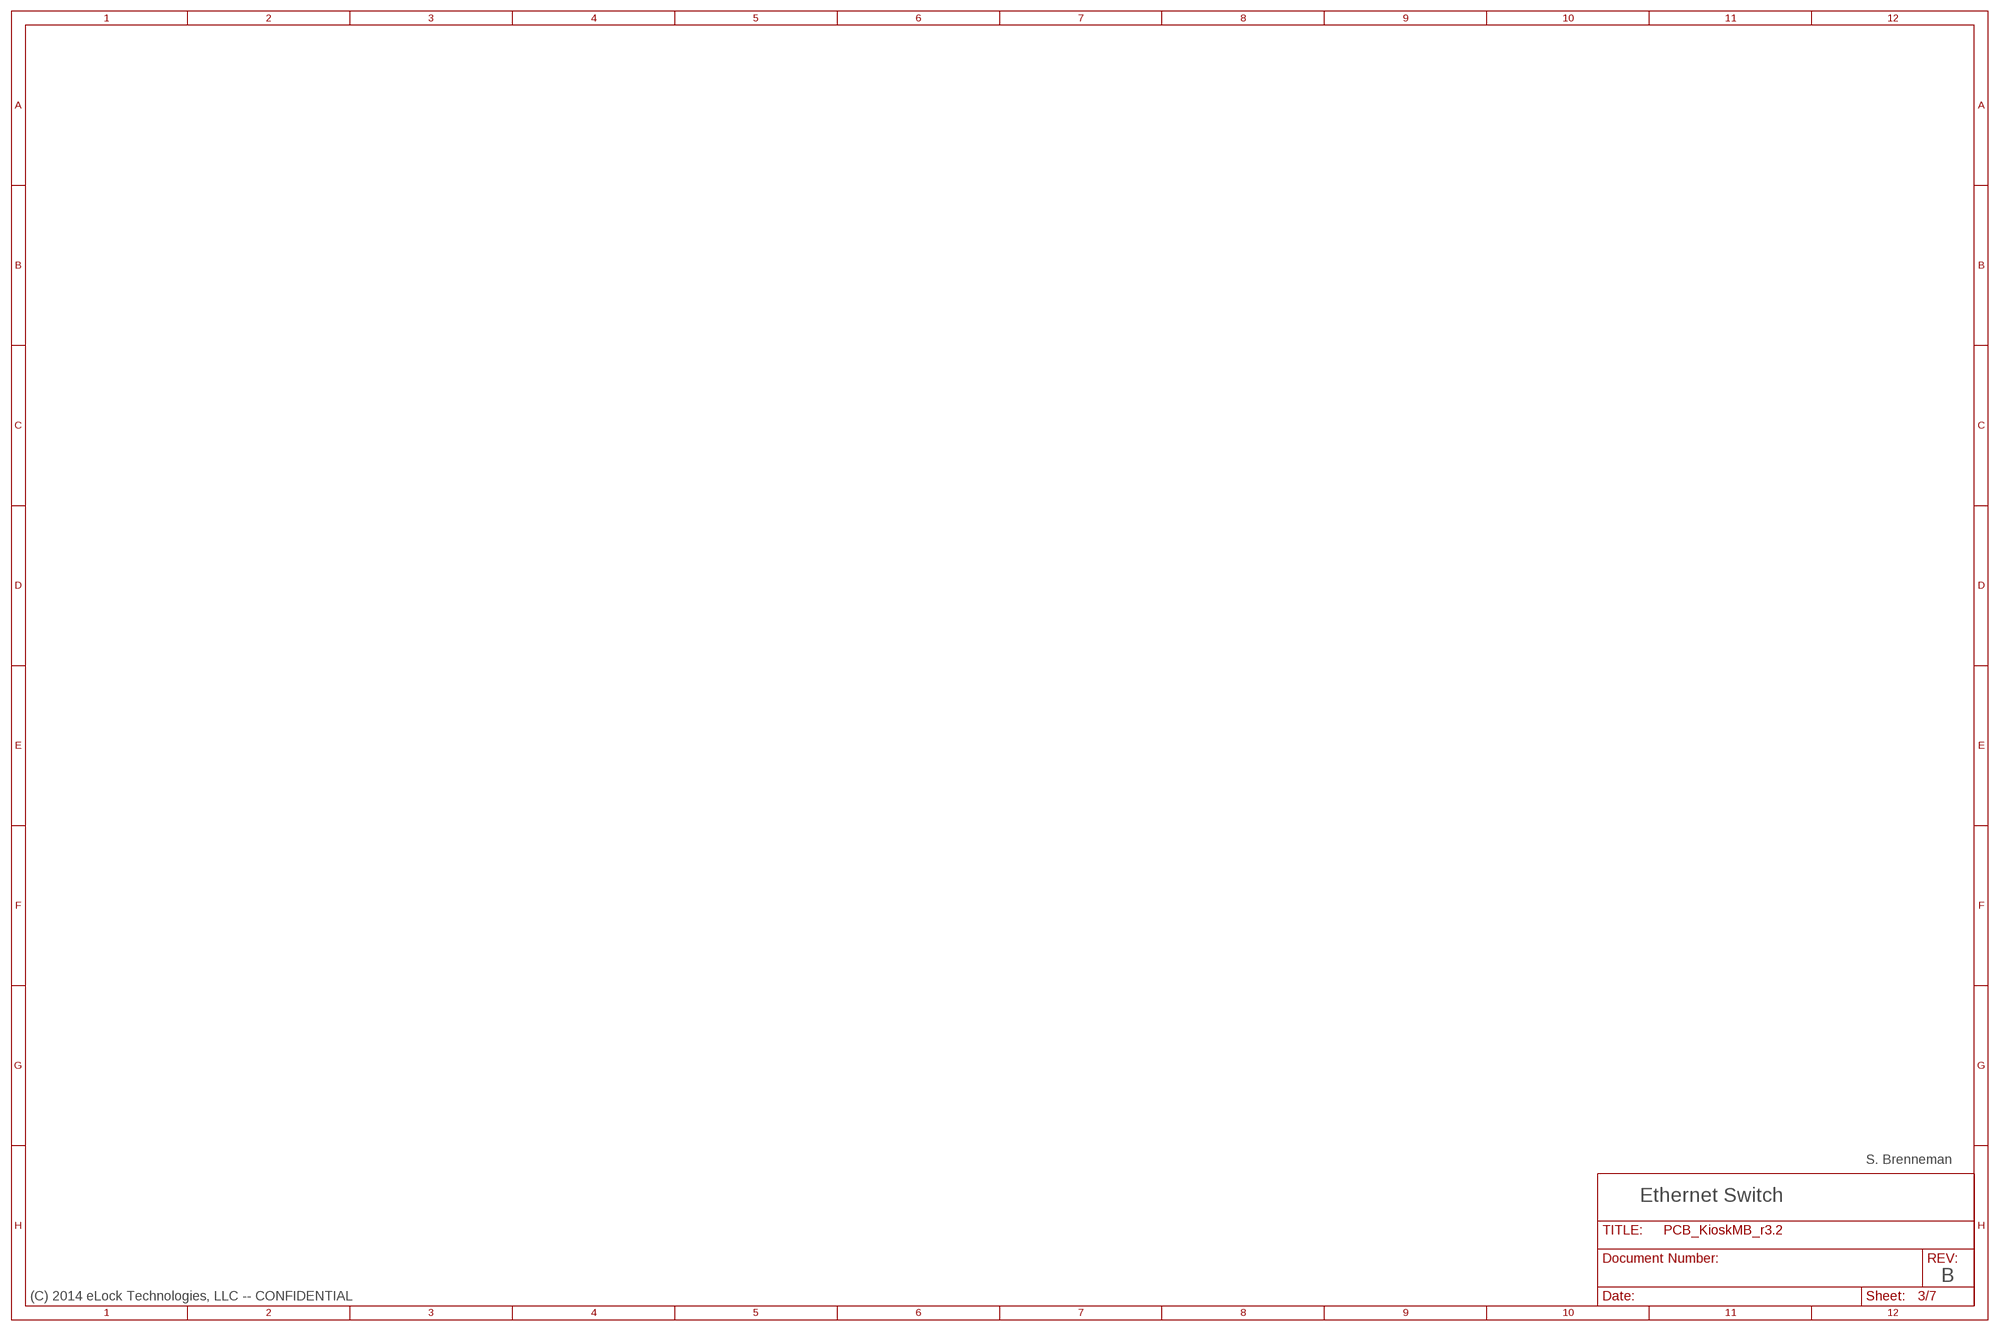
[diagram p4: schematic, sheet 3]

### Notes on the sheet
- S. Brenneman
- Ethernet Switch
- B
- (C) 2014 eLock Technologies, LLC -- CONFIDENTIAL

## Sheet 4 of 7
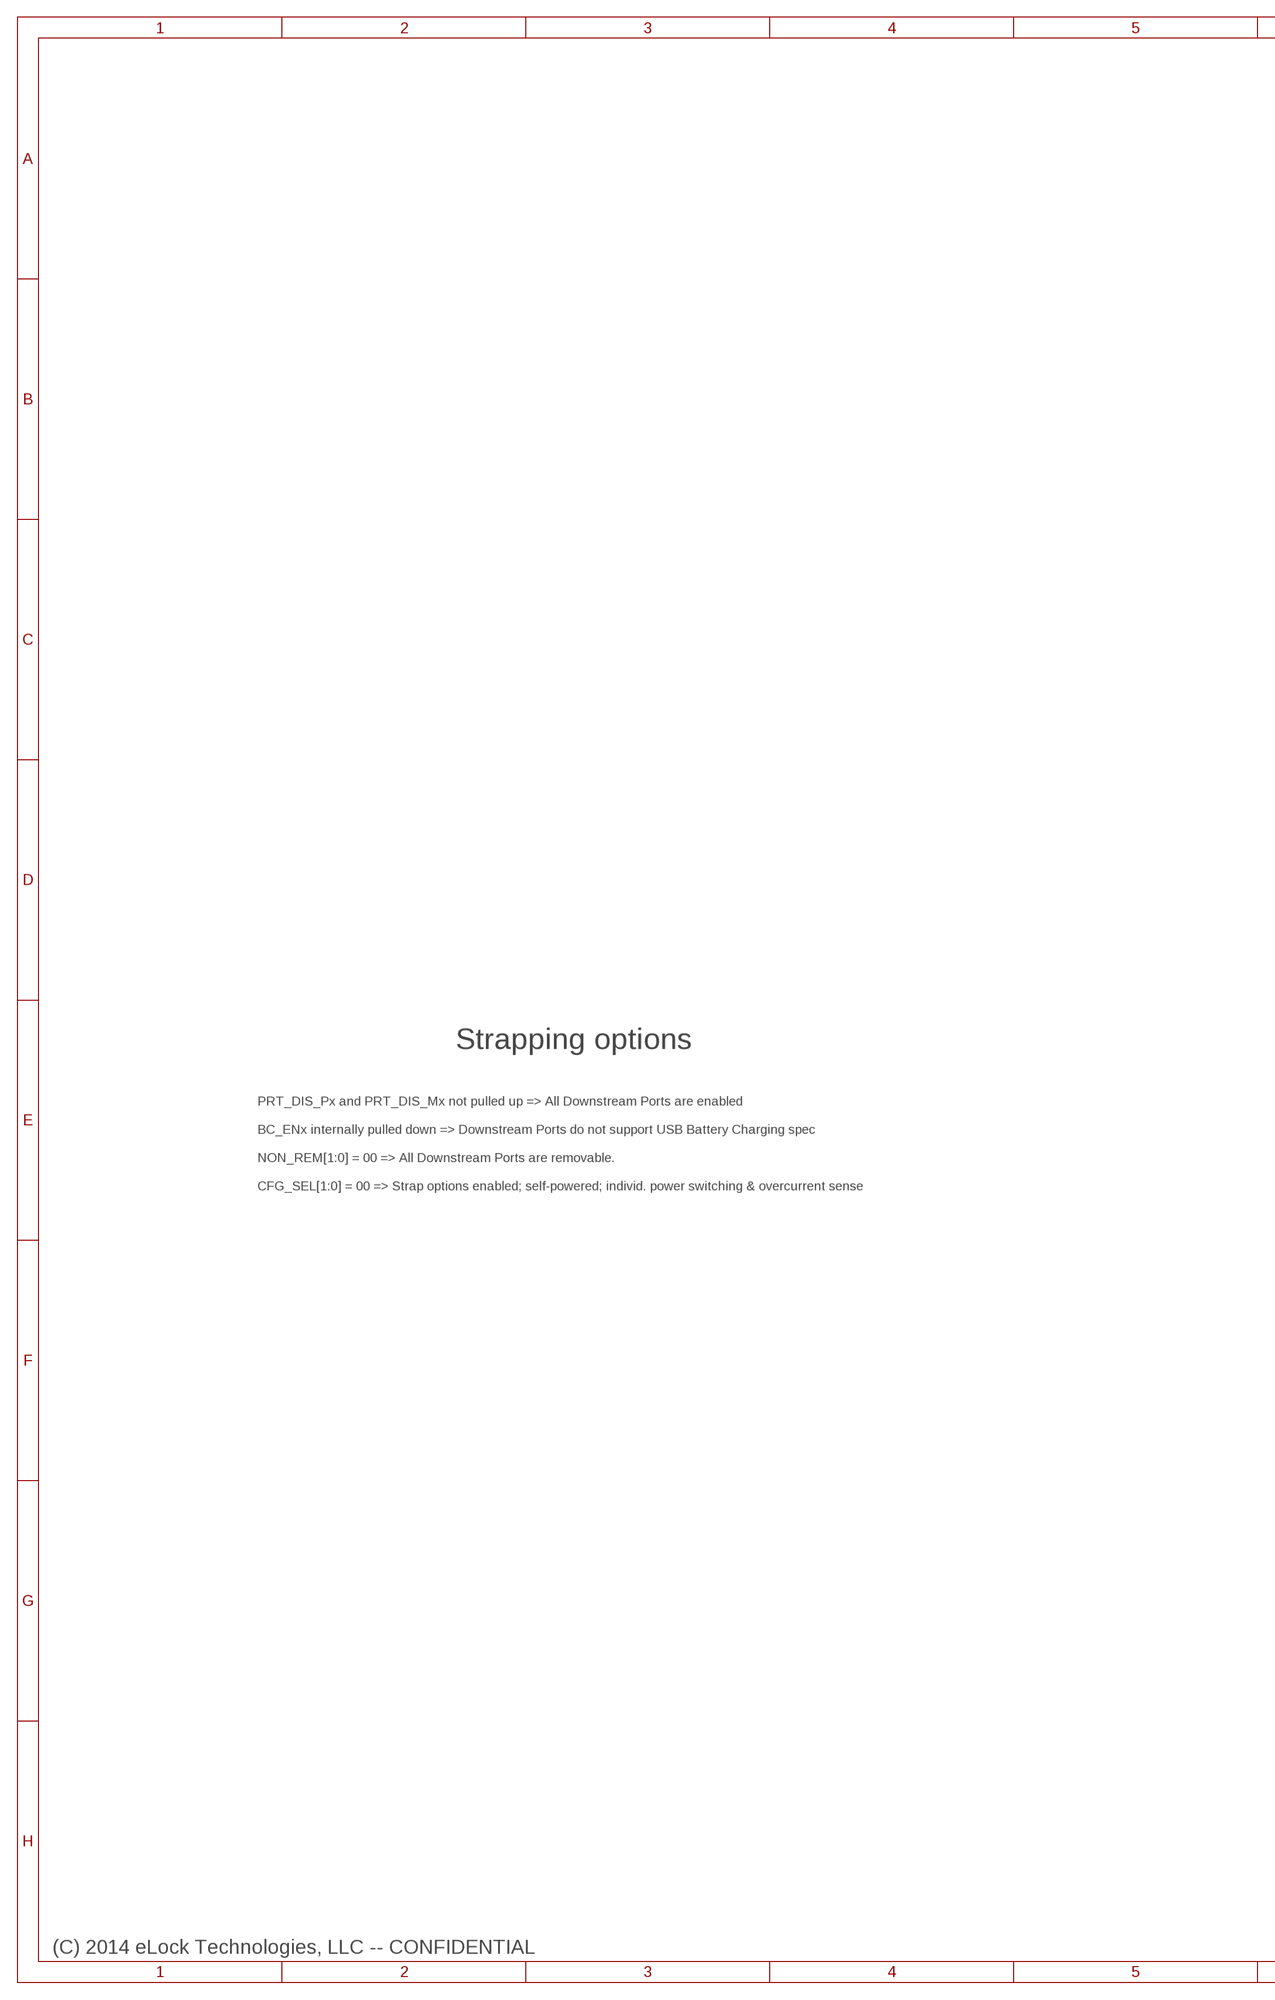
[diagram p5: schematic, sheet 4, part 1 of 2]
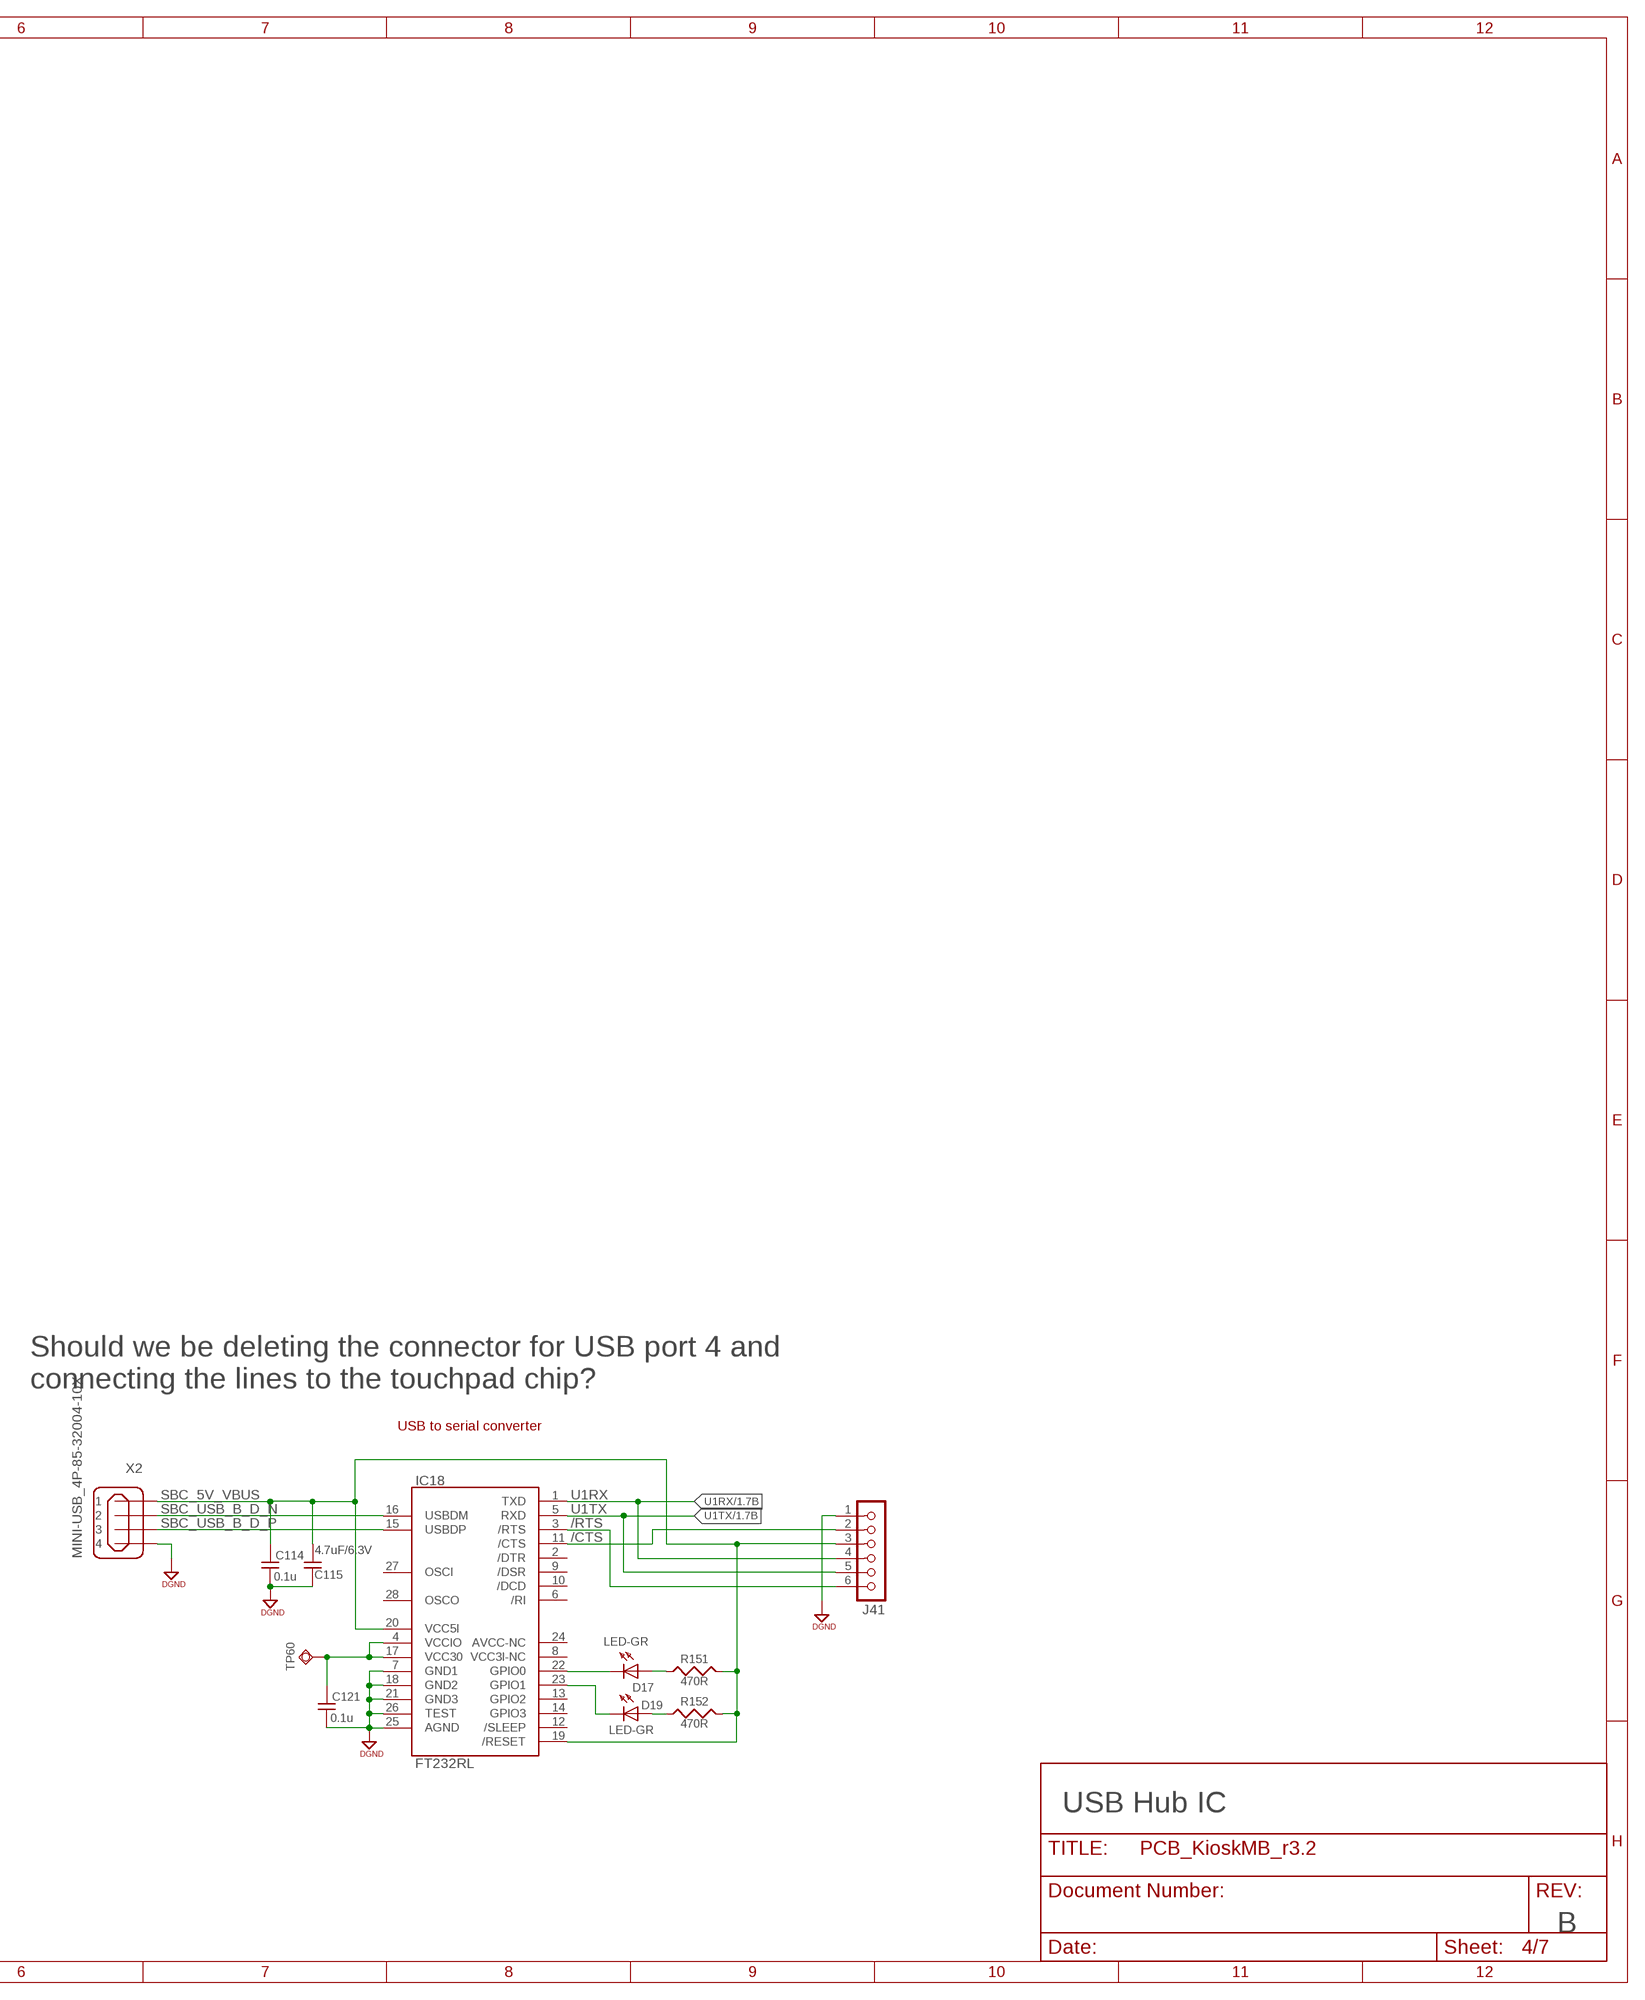
[diagram p6: schematic, sheet 4, part 2 of 2]

### Parts
C114  0.1u  C-0603  [0603]
C115  4.7uF/6.3V  C-0603  [0603]
C121  0.1u  C-0603  [0603]
D17  LED-GR  LED-0805  [0805-POL]
D19  LED-GR  LED-0805  [0805-POL]
IC18  FT232RL  [SSOP28DB]
J41  MA06-1  [MA06-1]
R151  470R  R-0603  [0603]
R152  470R  R-0603  [0603]
TP60  ROUND_SMD0.7MM  [SMD_ROUND_07MM]
X2  MINI-USB_4P-85-32004-10X  [85-32004-10X]

### Nets
/CTS: IC18.11(/CTS) J41.2
/RTS: IC18.3(/RTS) J41.6
DGND: C114.1 C115.1 C121.1 IC18.7(GND1) IC18.18(GND2) IC18.21(GND3) IC18.25(AGND) IC18.26(TEST) J41.1 X2.4 ; also sheet 1,2,5,6
N$72: C121.2 IC18.4(VCCIO) IC18.17(VCC30) TP60.P$1(TP)
N$134: D17.1+(K) IC18.22(GPIO0)
N$135: D19.1+(K) IC18.23(GPIO1)
N$136: D17.2(A) R151.1
N$137: D19.2(A) R152.1
SBC_5V_VBUS: C114.2 C115.2 IC18.19(/RESET) IC18.20(VCC5I) J41.3 R151.2 R152.2 X2.1
SBC_USB_B_D_N: IC18.16(USBDM) X2.2
SBC_USB_B_D_P: IC18.15(USBDP) X2.3
U1RX: IC18.1(TXD) J41.4 ; also sheet 1
U1TX: IC18.5(RXD) J41.5 ; also sheet 1
Unconnected: IC18.2(/DTR) IC18.6(/RI) IC18.8(VCC3I-NC) IC18.9(/DSR) IC18.10(/DCD) IC18.12(/SLEEP) IC18.13(GPIO2) IC18.14(GPIO3) IC18.24(AVCC-NC) IC18.27(OSCI) IC18.28(OSCO)

### Notes on the sheet
- Strapping options
- PRT_DIS_Px and PRT_DIS_Mx not pulled up => All Downstream Ports are enabled
- BC_ENx internally pulled down => Downstream Ports do not support USB Battery Charging spec
- NON_REM[1:0] = 00 => All Downstream Ports are removable.
- CFG_SEL[1:0] = 00 => Strap options enabled; self-powered; individ. power switching & overcurrent sense
- Should we be deleting the connector for USB port 4 and 
  connecting the lines to the touchpad chip?
- USB to serial converter
- USB Hub IC
- B
- (C) 2014 eLock Technologies, LLC -- CONFIDENTIAL

## Sheet 5 of 7
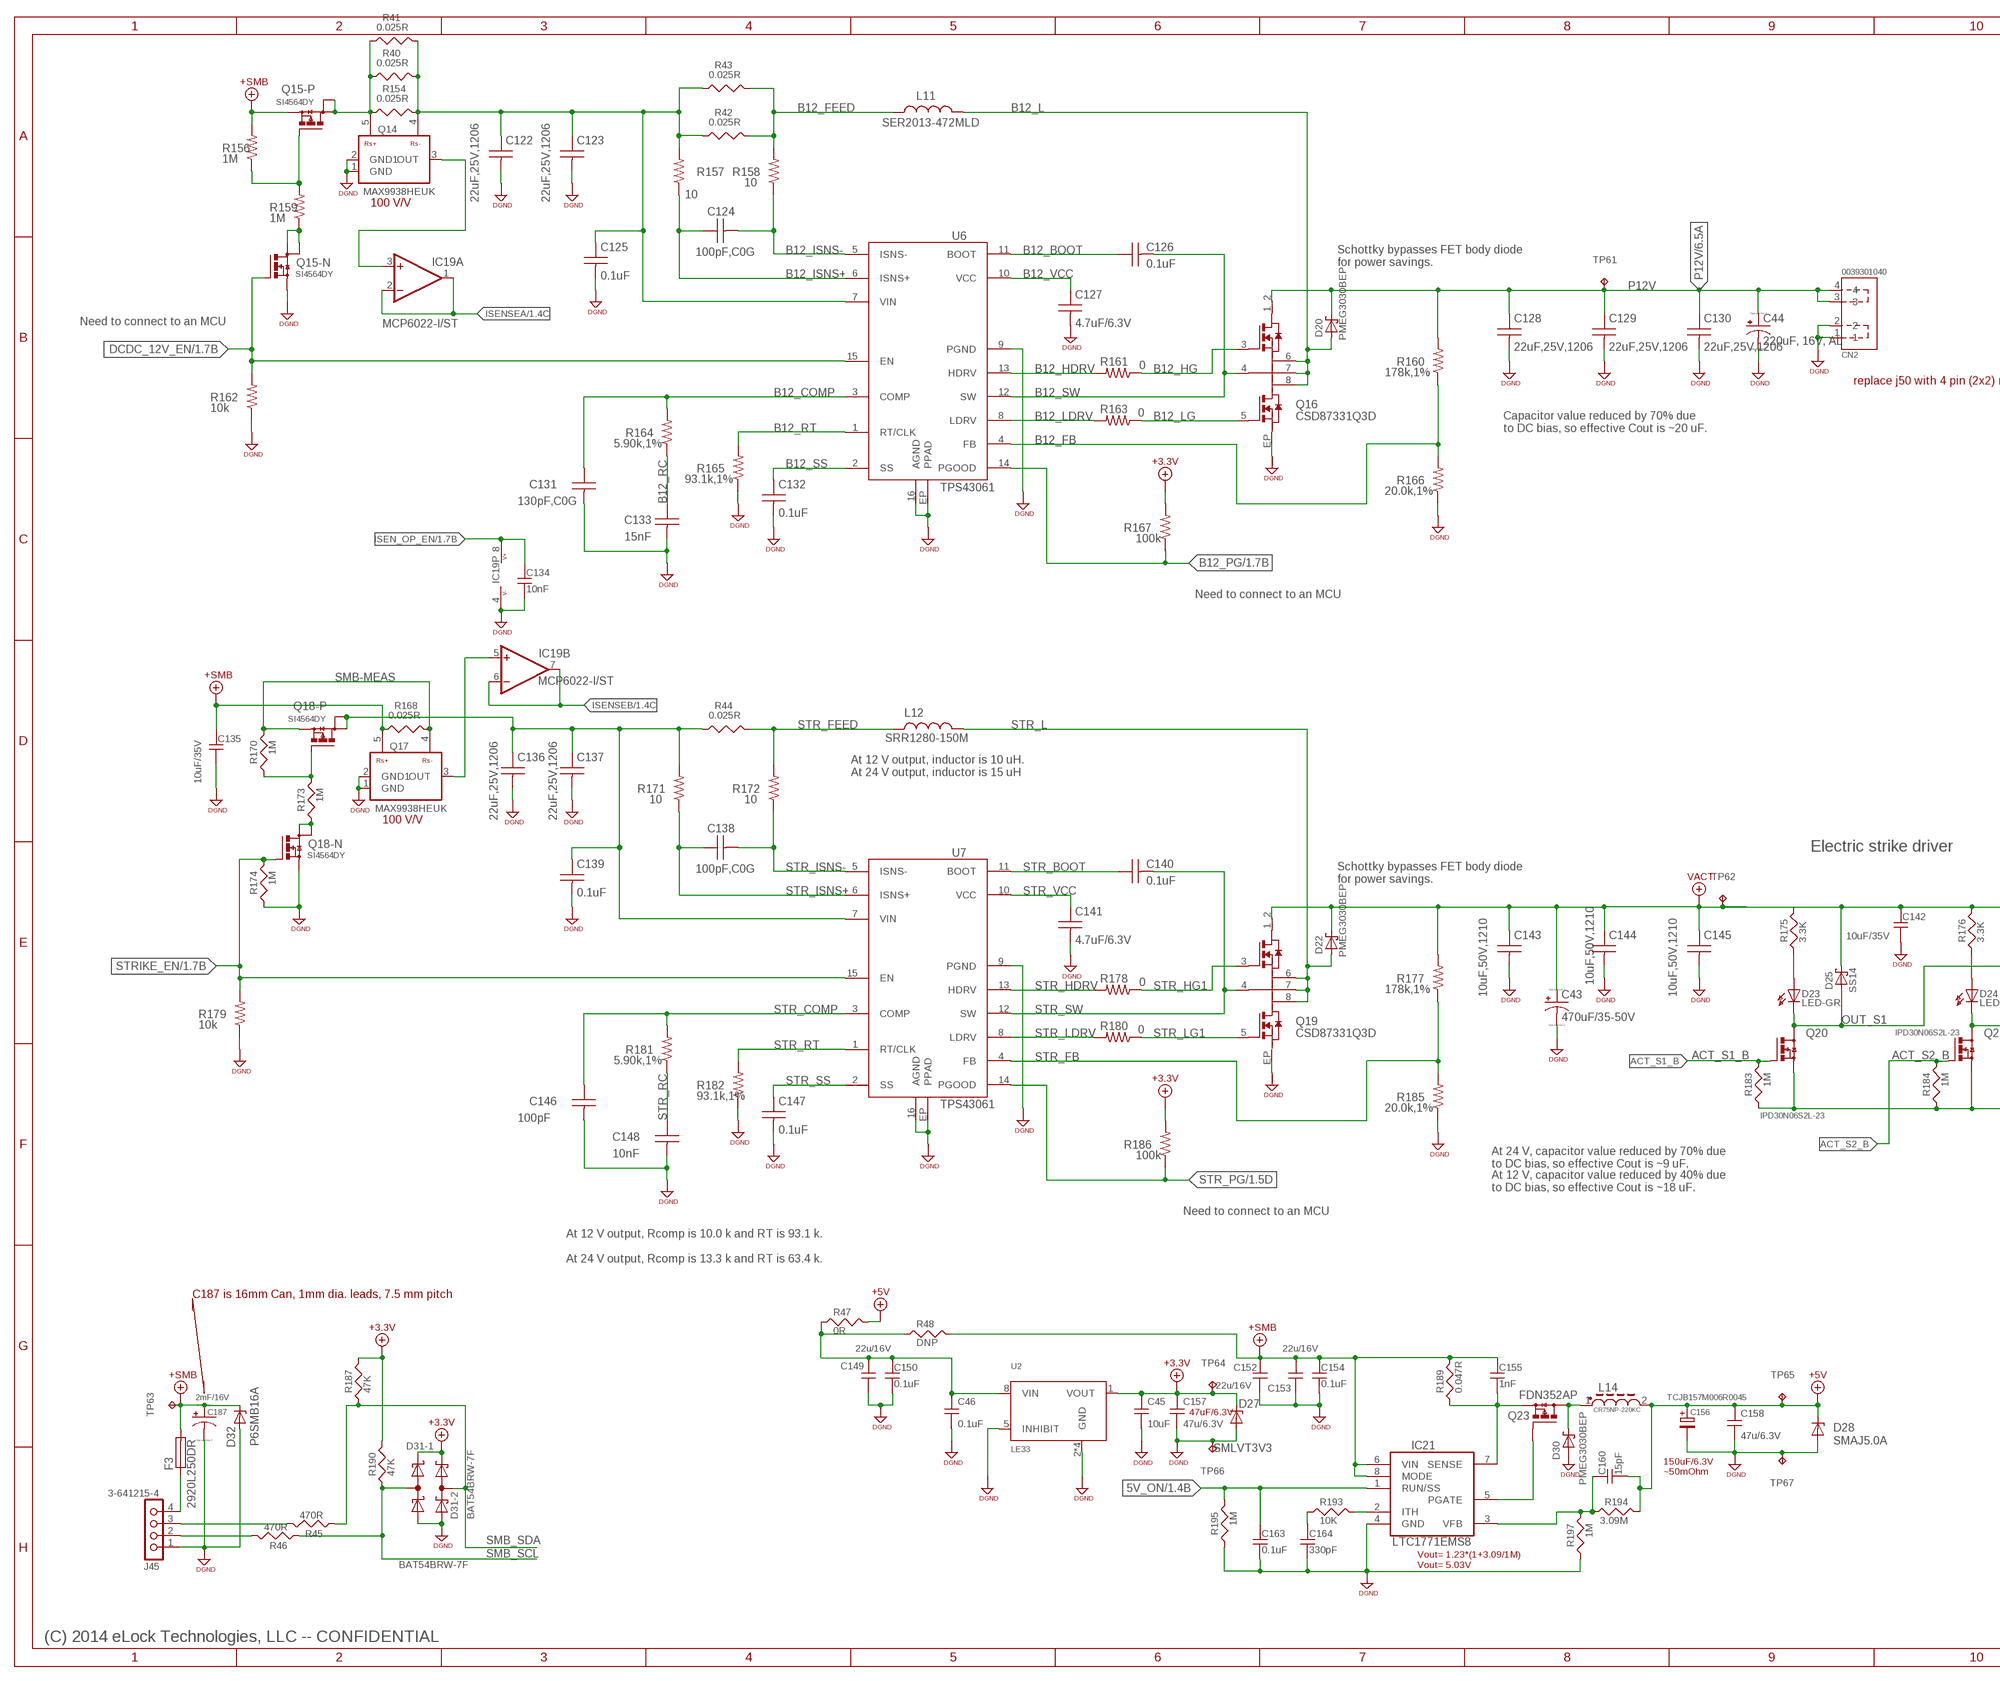
[diagram p7: schematic, sheet 5, part 1 of 2]
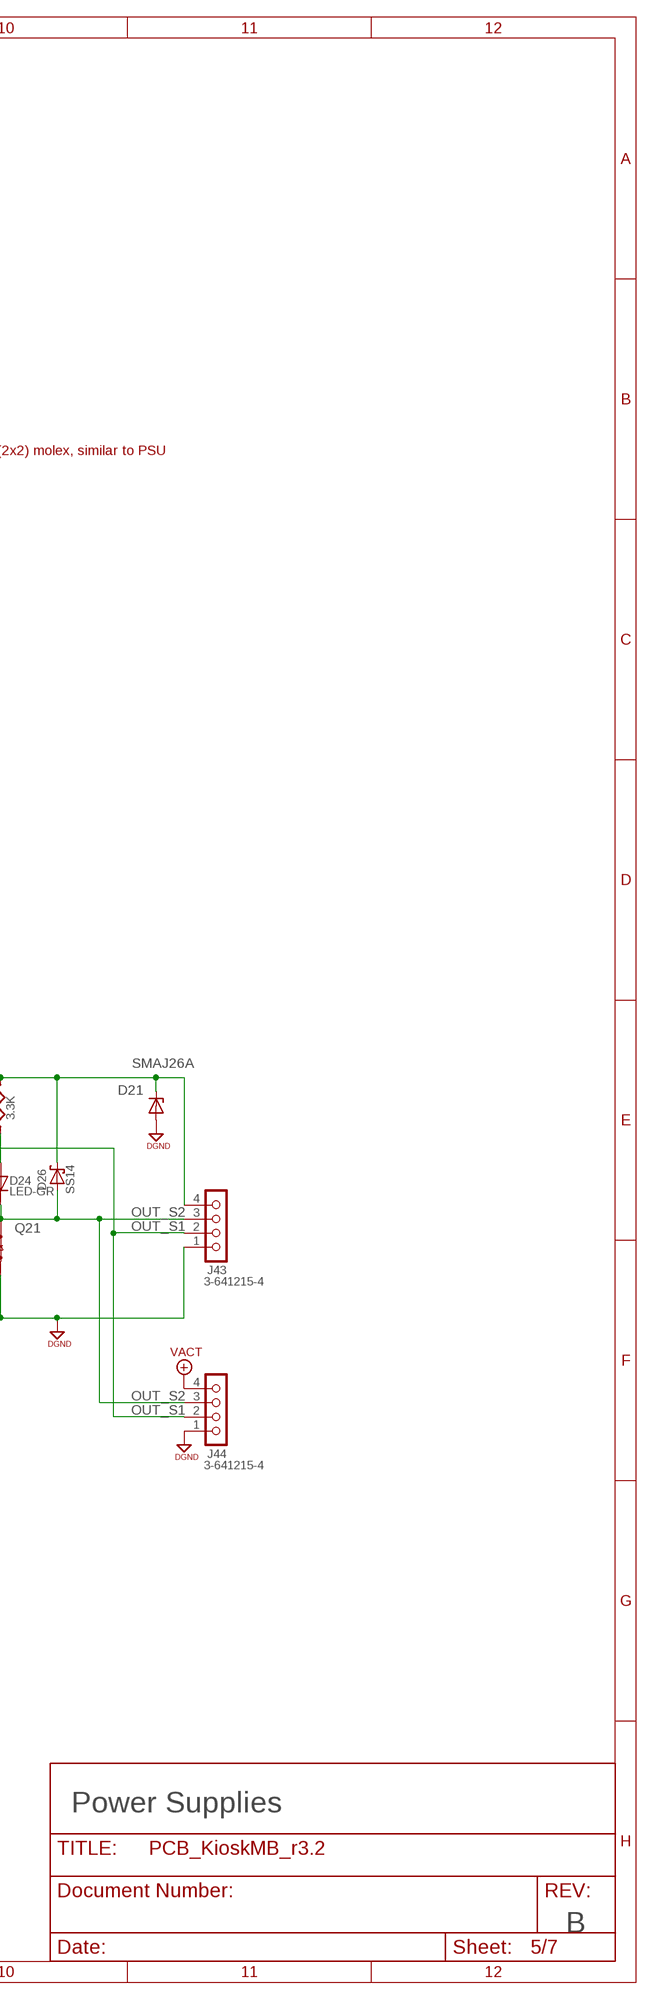
[diagram p8: schematic, sheet 5, part 2 of 2]

### Parts
C43  470uF/35-50V  CPOL-USE5-13  [E5-13]
C44  220uF, 16V, AL  CPOL-US153CLV-0605  [153CLV-0605]
C45  10uF  C-1210  [1210]
C46  0.1uF  C-1210  [1210]
C122  22uF,25V,1206  C-US-NP1206  [C1206]
C123  22uF,25V,1206  C-US-NP1206  [C1206]
C124  100pF,C0G  C-US-NP0603  [C0603]
C125  0.1uF  C-US-NP0603  [C0603]
C126  0.1uF  C-US-NP0603  [C0603]
C127  4.7uF/6.3V  C-US-NP0603  [C0603]
C128  22uF,25V,1206  C-US-NP1206  [C1206]
C129  22uF,25V,1206  C-US-NP1206  [C1206]
C130  22uF,25V,1206  C-US-NP1206  [C1206]
C131  130pF,C0G  C-US-NP0603  [C0603]
C132  0.1uF  C-US-NP0603  [C0603]
C133  15nF  C-US-NP0603  [C0603]
C134  10nF  C-0603  [0603]
C135  10uF/35V  C-1206  [1206]
C136  22uF,25V,1206  C-US-NP1206  [C1206]
C137  22uF,25V,1206  C-US-NP1206  [C1206]
C138  100pF,C0G  C-US-NP0603  [C0603]
C139  0.1uF  C-US-NP0603  [C0603]
C140  0.1uF  C-US-NP0603  [C0603]
C141  4.7uF/6.3V  C-US-NP0603  [C0603]
C142  10uF/35V  C-1206  [1206]
C143  10uF,50V,1210  C-US-NP1210  [C1210]
C144  10uF,50V,1210  C-US-NP1210  [C1210]
C145  10uF,50V,1210  C-US-NP1210  [C1210]
C146  100pF  C-US-NP0603  [C0603]
C147  0.1uF  C-US-NP0603  [C0603]
C148  10nF  C-US-NP0603  [C0603]
C149  22u/16V  C-1210  [1210]
C150  0.1uF  C-0603  [0603]
C152  22u/16V  C-1210  [1210]
C153  22u/16V  C-1210  [1210]
C154  0.1uF  C-0603  [0603]
C155  1nF  C-0603  [0603]
C156  TCJB157M006R0045  C-POL-3528  [3528-POL]
C157  47u/6.3V  C-1210  [1210]
C158  47u/6.3V  C-1210  [1210]
C160  15pF  C-0603  [0603]
C163  0.1uF  C-0603  [0603]
C164  330pF  C-0603  [0603]
C187  2mF/16V  CPOL-USE7.5-18  [E7,5-18]
CN2  0039301040  [0039301040]
D20  PMEG3030BEP  [SOD-128]
D21  SMAJ26A  SMAJ5.0A  [SMA]
D22  PMEG3030BEP  [SOD-128]
D23  LED-GR  LED-0805  [0805-POL]
D24  LED-GR  LED-0805  [0805-POL]
D25  SS14  [SMA]
D26  SS14  [SMA]
D27  SMLVT3V3  [SMA]
D28  SMAJ5.0A  [SMA]
D30  PMEG3030BEP  [SOD-128]
D31  BAT54BRW-7F  [SOT-363]
D32  P6SMB16A  [SMB]
F3  2920L250DR  1812L014DR  [1812]
IC19  MCP6022-I/ST  [TSSOP8]
IC21  LTC1771EMS8  [MSOP-08]
J43  3-641215-4  [3-641215-4]
J44  3-641215-4  [3-641215-4]
J45  3-641215-4  [3-641215-4]
L11  SER2013-472MLD  LSER20XX  [L_SER20XX]
L12  SRR1280-150M  LSRR1280  [L_SRR1280]  (variant 12V_STRIKE: 10uH)  (variant 24V_STRIKE: 15uH)
L14  CR75NP-220KC  CR75-330KC  [CR75]
Q14  MAX9938HEUK  TSM9938HEUK+T  [SOT23-5]
Q15  SI4564DY  [SO-08]
Q16  CSD87331Q3D  TRANS_DUAL_NFET_HALF-BRQ3D  [SON8_3.3X3.3_TI]
Q17  MAX9938HEUK  TSM9938HEUK+T  [SOT23-5]
Q18  SI4564DY  [SO-08]
Q19  CSD87331Q3D  TRANS_DUAL_NFET_HALF-BRQ3D  [SON8_3.3X3.3_TI]
Q20  IPD30N06S2L-23  [TO252]
Q21  IPD30N06S2L-23  [TO252]
Q23  FDN352AP  [SOT-23]
R40  0.025R  R-0805  [0805]
R41  0.025R  R-0805  [0805]
R42  0.025R  R-0805  [0805]
R43  0.025R  R-0805  [0805]
R44  0.025R  R-0805  [0805]
R45  470R  R-0603  [0603]
R46  470R  R-0603  [0603]
R47  0R  R-0603  [0603]
R48  DNP  R-0603  [0603]
R154  0.025R  R-0805  [0805]
R156  1M  R-US_R0603  [R0603]
R157  10  R-US_R0603  [R0603]
R158  10  R-US_R0603  [R0603]
R159  1M  R-US_R0603  [R0603]
R160  178k,1%  R-US_R0603  [R0603]
R161  0  R-US_R0603  [R0603]
R162  10k  R-US_R0603  [R0603]
R163  0  R-US_R0603  [R0603]
R164  5.90k,1%  R-US_R0603  [R0603]
R165  93.1k,1%  R-US_R0603  [R0603]
R166  20.0k,1%  R-US_R0603  [R0603]
R167  100k  R-US_R0603  [R0603]
R168  0.025R  R-0805  [0805]
R170  1M  R-0603  [0603]
R171  10  R-US_R0603  [R0603]
R172  10  R-US_R0603  [R0603]
R173  1M  R-0603  [0603]
R174  1M  R-0603  [0603]
R175  3.3K  R-0805  [0805]
R176  3.3K  R-0805  [0805]
R177  178k,1%  R-US_R0603  [R0603]
R178  0  R-US_R0603  [R0603]
R179  10k  R-US_R0603  [R0603]
R180  0  R-US_R0603  [R0603]
R181  5.90k,1%  R-US_R0603  [R0603]  (variant 12V_STRIKE: 10.0k,1%)  (variant 24V_STRIKE: 13.3k,1%)
R182  93.1k,1%  R-US_R0603  [R0603]  (variant 24V_STRIKE: 63.4k,1%)
R183  1M  R-0603  [0603]
R184  1M  R-0603  [0603]
R185  20.0k,1%  R-US_R0603  [R0603]
R186  100k  R-US_R0603  [R0603]
R187  47K  R-0603  [0603]
R189  0.047R  R-0805  [0805]
R190  47K  R-0603  [0603]
R193  10K  R-0603  [0603]
R194  3.09M  R-0603  [0603]
R195  1M  R-0603  [0603]
R197  1M  R-0603  [0603]
TP61  TPB1,27  [B1,27]
TP62  TPB1,27  [B1,27]
TP63  TPB1,27  [B1,27]
TP64  TPB1,27  [B1,27]
TP65  TPB1,27  [B1,27]
TP66  TPB1,27  [B1,27]
TP67  TPB1,27  [B1,27]
U2  LE33  [LE33]
U6  TPS43061  IC_TI_TPS43061RTE  [QFN16_3X3_EP]
U7  TPS43061  IC_TI_TPS43061RTE  [QFN16_3X3_EP]

### Nets
5V_ON: C163.1 IC21.1(RUN/SS) R195.1 ; also sheet 1
+3.3V: C45.1 C157.1 D27.+(C) D31.4(-2:K) D31.5(-1:K) R167.2 R186.2 R187.2 R190.2 TP64.TP U2.1(VOUT) ; also sheet 1
+5V: C156.1(PIN+) C158.1 C160.2 D28.+(C) L14.2 R47.2 R194.1 TP65.TP ; also sheet 2
+SMB: C135.1 C152.1 C153.1 C154.1 C155.1 C187.+ D32.C F3.2 IC21.6(VIN) IC21.8(MODE) Q15.3(-P:S) Q17.5(VIN+) R48.2 R156.2 R168.1 R189.2 TP63.TP ; also sheet 1
+SMB_PRE: F3.1 J45.4 ; also sheet 2
ACT_S1_B: Q20.1(G) R183.1 ; also sheet 1
ACT_S2_B: Q21.1(G) R184.1 ; also sheet 1
B12_BOOT: C126.1 U6.11(BOOT)
B12_COMP: C131.1 R164.2 U6.3(COMP)
B12_FB: R160.1 R166.2 U6.4(FB)
B12_FEED: L11.2 R42.2 R43.2 R158.2
B12_HDRV: R161.2 U6.13(HDRV)
B12_HG: Q16.3(TG) R161.1
B12_ISNS+: C124.1 R157.1 U6.6(ISNS+)
B12_ISNS-: C124.2 R158.1 U6.5(ISNS-)
B12_L: D20.A L11.1 Q16.6(VSW) Q16.7(VSW) Q16.8(VSW)
B12_LDRV: R163.2 U6.8(LDRV)
B12_LG: Q16.5(BG) R163.1
B12_PG: R167.1 U6.14(PGOOD) ; also sheet 1
B12_RC: C133.1 R164.1
B12_RT: R165.2 U6.1(RT/CLK)
B12_SS: C132.1 U6.2(SS)
B12_SW: C126.2 Q16.4(TGR) U6.12(SW)
B12_VCC: C127.1 U6.10(VCC)
DCDC12VIN: C122.1 C123.1 C125.1 Q14.4(VIN-) R40.2 R41.2 R42.1 R43.1 R154.2 R157.2 U6.7(VIN)
DCDC_12V_EN: Q15.2(-N:G) R162.2 U6.15(EN) ; also sheet 1
DGND: C43.- C44.- C45.2 C46.2 C122.2 C123.2 C125.2 C127.2 C128.2 C129.2 C130.2 C131.2 C132.2 C133.2 C134.2 C135.2 C136.2 C137.2 C139.2 C141.2 C142.2 C143.2 C144.2 C145.2 C146.2 C147.2 C148.2 C149.2 C150.2 C152.2 C153.2 C154.2 C156.2(PIN-) C157.2 C158.2 C163.2 C164.2 C187.- CN2.1 CN2.2 D21.-(A) D27.-(A) D28.-(A) D30.A D31.1(-1:A) D31.2(-2:A) D32.A IC19.4(P:V-) IC21.4(GND) J43.1 J44.1 J45.1 Q14.1(GND) Q14.2(GND1) Q15.1(-N:S) Q16.EP(PGND) Q17.1(GND) Q17.2(GND1) Q18.1(-N:S) Q19.EP(PGND) Q20.2(S) Q21.2(S) R162.1 R165.1 R166.1 R174.2 R179.1 R182.1 R183.2 R184.2 R185.1 R195.2 R197.2 TP66.TP TP67.TP U2.2(GND) U2.3(GND) U2.5(INHIBIT) U2.6(GND) U2.7(GND) U6.9(PGND) U6.16(AGND) U6.EP(PPAD) U7.9(PGND) U7.16(AGND) U7.EP(PPAD) ; also sheet 1,2,4,6
ISEN_OP_EN: C134.1 IC19.8(P:V+) ; also sheet 1
ISENSEA: IC19.1(A:OUT) IC19.2(A:-IN) ; also sheet 1
ISENSEB: IC19.6(B:-IN) IC19.7(B:OUT) ; also sheet 1
N$4: Q14.5(VIN+) Q15.5(-P:D) Q15.6(-P:D1) R40.1 R41.1 R154.1
N$6: IC21.5(PGATE) Q23.1(G)
N$10: IC19.3(A:+IN) Q14.3(OUT)
N$11: IC21.2(ITH) R193.2
N$17: C164.1 R193.1
N$20: D30.K L14.1 Q23.3(D)
N$24: C155.2 IC21.7(SENSE) Q23.2(S) R189.1
N$26: Q15.4(-P:G) R156.1 R159.2
N$32: C160.1 IC21.3(VFB) R194.2 R197.1
N$42: J45.2 R46.2
N$45: D23.2(A) R175.1
N$46: D24.2(A) R176.1
N$47: J45.3 R45.2
N$48: C46.1 C149.1 C150.1 R47.1 R48.1 U2.8(VIN)
N$51: Q18.4(-P:G) R170.2 R173.1
N$61: IC19.5(B:+IN) Q17.3(OUT)
N$73: Q15.7(-N:D) Q15.8(-N:D1) R159.1
N$74: Q18.7(-N:D) Q18.8(-N:D1) R173.2
OUT_S1: D23.1+(K) D25.A J43.2 J44.2 Q20.3(D)
OUT_S2: D24.1+(K) D26.A J43.3 J44.3 Q21.3(D)
P12V: C44.+ C128.1 C129.1 C130.1 CN2.3 CN2.4 D20.K Q16.1_2(VIN) R160.2 TP61.TP ; also sheet 6
SMB-MEAS: Q17.4(VIN-) Q18.3(-P:S) R168.2 R170.1
SMB_SCL: D31.6(-1:AK) R46.1 R190.1 ; also sheet 1
SMB_SDA: D31.3(-2:AK) R45.1 R187.1 ; also sheet 1
STR_BOOT: C140.1 U7.11(BOOT)
STR_COMP: C146.1 R181.2 U7.3(COMP)
STR_FB: R177.1 R185.2 U7.4(FB)
STR_FEED: L12.2 R44.2 R172.2
STR_HDRV: R178.2 U7.13(HDRV)
STR_HG1: Q19.3(TG) R178.1
STR_ISNS+: C138.1 R171.1 U7.6(ISNS+)
STR_ISNS-: C138.2 R172.1 U7.5(ISNS-)
STR_L: D22.A L12.1 Q19.6(VSW) Q19.7(VSW) Q19.8(VSW)
STR_LDRV: R180.2 U7.8(LDRV)
STR_LG1: Q19.5(BG) R180.1
STR_PG: R186.1 U7.14(PGOOD) ; also sheet 1
STR_RC: C148.1 R181.1
STR_RT: R182.2 U7.1(RT/CLK)
STR_SS: C147.1 U7.2(SS)
STR_SW: C140.2 Q19.4(TGR) U7.12(SW)
STR_VCC: C141.1 U7.10(VCC)
STRIKE_EN: Q18.2(-N:G) R174.1 R179.2 U7.15(EN) ; also sheet 1
VACT: C43.+ C142.1 C143.1 C144.1 C145.1 D21.+(C) D22.K D25.C(K) D26.C(K) J43.4 J44.4 Q19.1_2(VIN) R175.2 R176.2 R177.2 TP62.TP
VSUPLYACT: C136.1 C137.1 C139.1 Q18.5(-P:D) Q18.6(-P:D1) R44.1 R171.2 U7.7(VIN)

### Notes on the sheet
- 100 V/V
- Schottky bypasses FET body diode
  for power savings.
- Need to connect to an MCU
- replace j50 with 4 pin (2x2) molex, similar to PSU
- Capacitor value reduced by 70% due 
  to DC bias, so effective Cout is ~20 uF.
- Need to connect to an MCU
- At 12 V output, inductor is 10 uH.
  At 24 V output, inductor is 15 uH
- 100 V/V
- Electric strike driver
- Schottky bypasses FET body diode
  for power savings.
- At 24 V, capacitor value reduced by 70% due 
  to DC bias, so effective Cout is ~9 uF.
- At 12 V, capacitor value reduced by 40% due 
  to DC bias, so effective Cout is ~18 uF.
- Need to connect to an MCU
- At 12 V output, Rcomp is 10.0 k and RT is 93.1 k.
  
  At 24 V output, Rcomp is 13.3 k and RT is 63.4 k.
- C187 is 16mm Can, 1mm dia. leads, 7.5 mm pitch
- 47uF/6.3V
- 150uF/6.3V
  ~50mOhm
- Power Supplies
- Vout= 1.23*(1+3.09/1M)
- Vout= 5.03V
- B
- (C) 2014 eLock Technologies, LLC -- CONFIDENTIAL

## Sheet 6 of 7
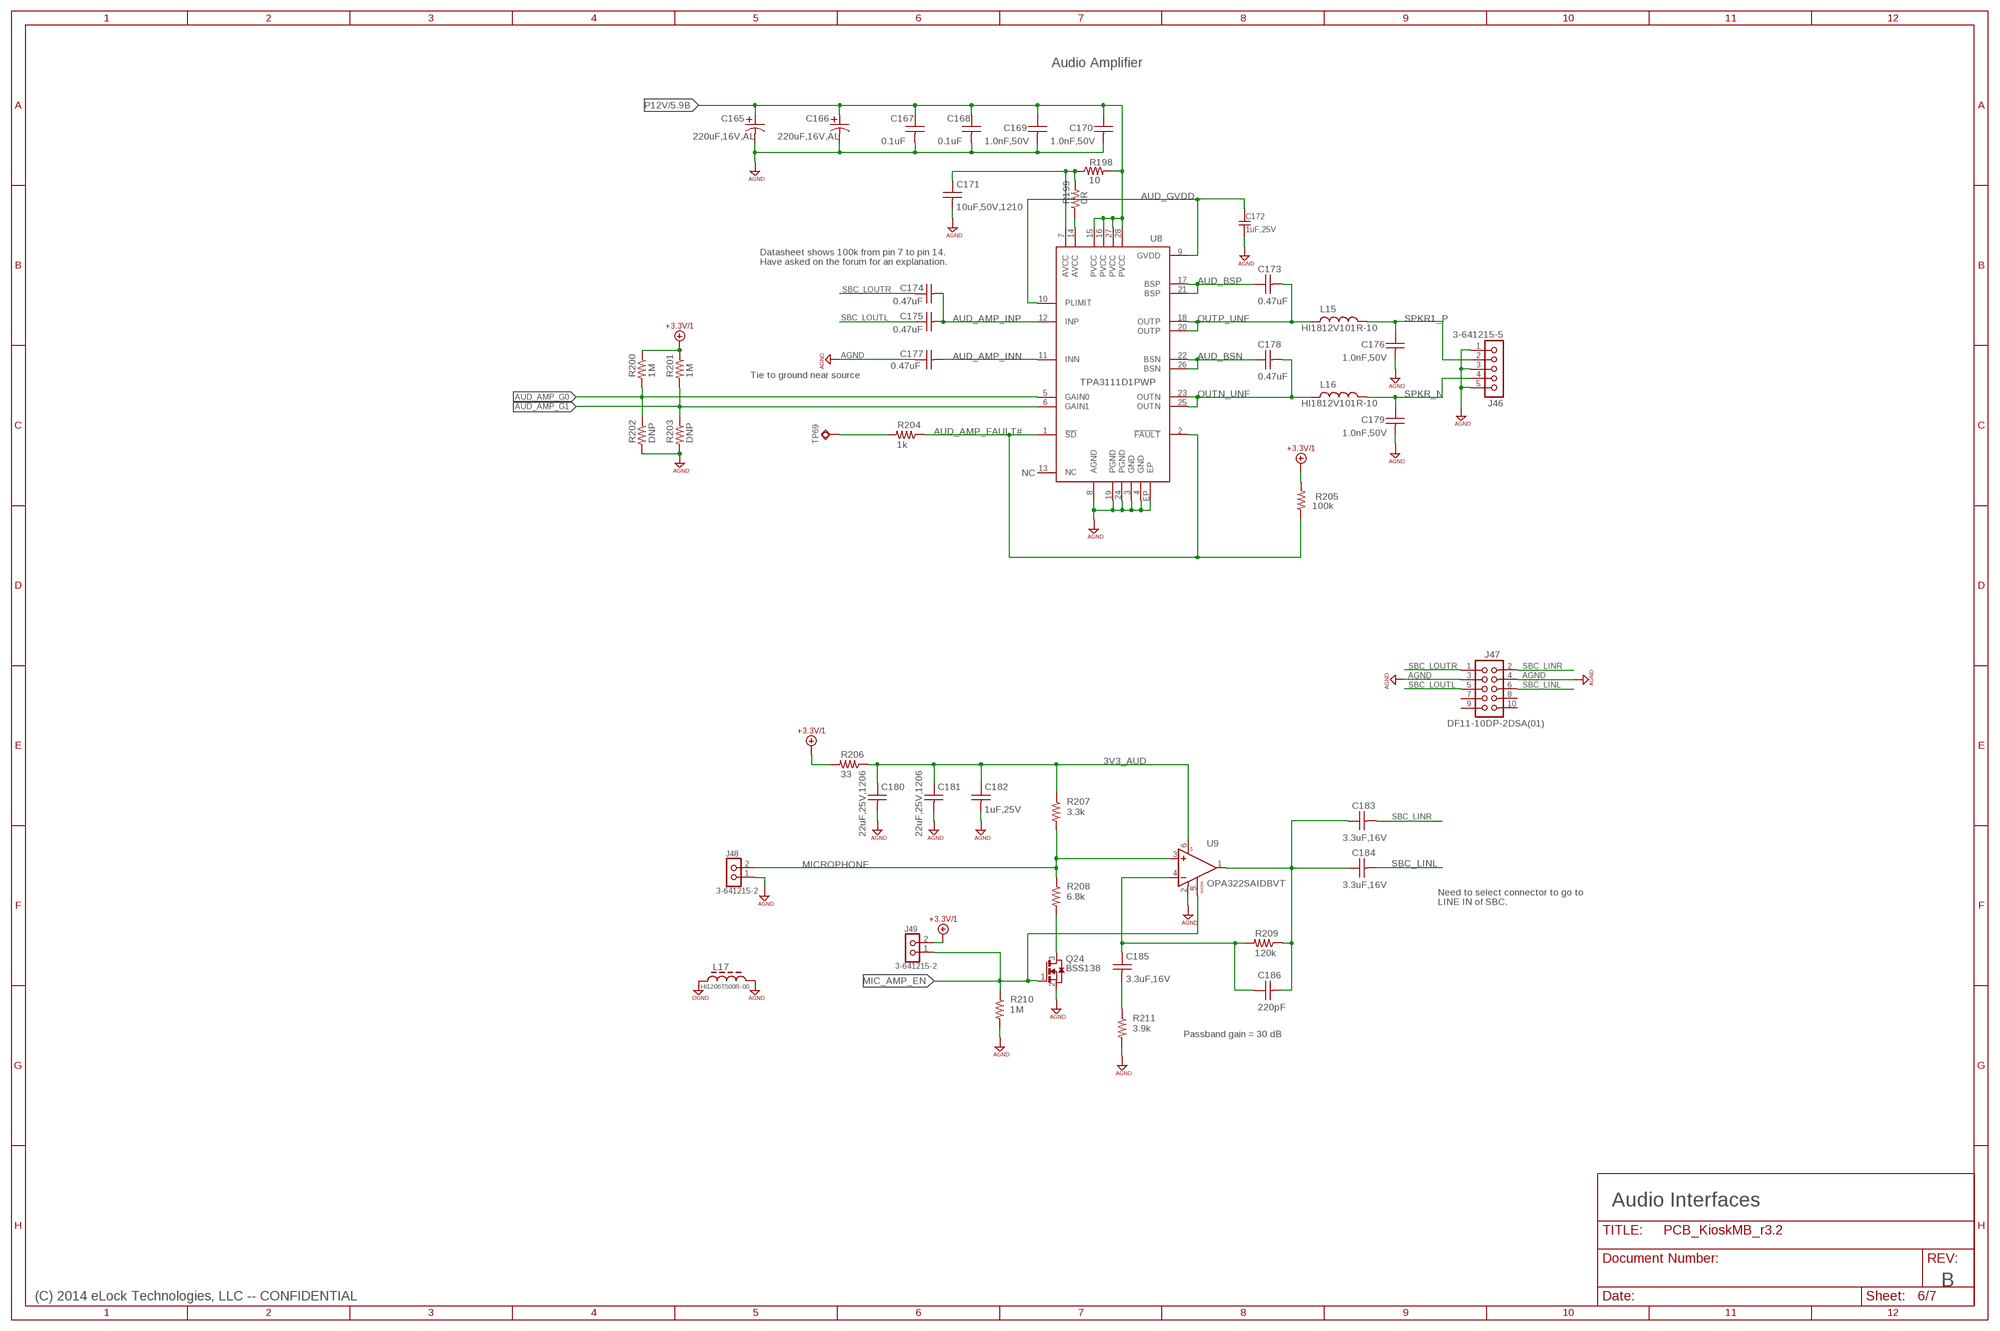
[diagram p9: schematic, sheet 6]

### Parts
C165  220uF,16V,AL  CAP_ELEC_6.3MM_SMD  [CAP_6.3MM_DIA_SMT]
C166  220uF,16V,AL  CAP_ELEC_6.3MM_SMD  [CAP_6.3MM_DIA_SMT]
C167  0.1uF  C-US-NP0603  [C0603]
C168  0.1uF  C-US-NP0603  [C0603]
C169  1.0nF,50V  C-US-NP0603  [C0603]
C170  1.0nF,50V  C-US-NP0603  [C0603]
C171  10uF,50V,1210  C-US-NP1210  [C1210]
C172  1uF,25V  C-0603  [0603]
C173  0.47uF  C-US-NP0603  [C0603]
C174  0.47uF  C-US-NP0603  [C0603]
C175  0.47uF  C-US-NP0603  [C0603]
C176  1.0nF,50V  C-US-NP0603  [C0603]
C177  0.47uF  C-US-NP0603  [C0603]
C178  0.47uF  C-US-NP0603  [C0603]
C179  1.0nF,50V  C-US-NP0603  [C0603]
C180  22uF,25V,1206  C-US-NP1206  [C1206]
C181  22uF,25V,1206  C-US-NP1206  [C1206]
C182  1uF,25V  C-US-NP0603  [C0603]
C183  3.3uF,16V  C-US-NP0603  [C0603]
C184  3.3uF,16V  C-US-NP0603  [C0603]
C185  3.3uF,16V  C-US-NP0603  [C0603]
C186  220pF  C-US-NP0603  [C0603]
J46  3-641215-5  [3-641215-5]
J47  DF11-10DP-2DSA(01)  [DF11-10DP-2DSA]
J48  3-641215-2  [3-641215-2]
J49  3-641215-2  [3-641215-2]
L15  HI1812V101R-10  L1812  [L1812]
L16  HI1812V101R-10  L1812  [L1812]
L17  HI1206T500R-00  L-1206  [1206]
Q24  BSS138  [SOT23]
R198  10  R-US_R0603  [R0603]
R199  0R  R-US_R0603  [R0603]
R200  1M  R-US_R0603  [R0603]
R201  1M  R-US_R0603  [R0603]
R202  DNP  R-US_R0603  [R0603]
R203  DNP  R-US_R0603  [R0603]
R204  1k  R-US_R0603  [R0603]
R205  100k  R-US_R0603  [R0603]
R206  33  R-US_R0603  [R0603]
R207  3.3k  R-US_R0603  [R0603]
R208  6.8k  R-US_R0603  [R0603]
R209  120k  R-US_R0603  [R0603]
R210  1M  R-US_R0603  [R0603]
R211  3.9k  R-US_R0603  [R0603]
TP69  P1-13  [P1-13@1]
U8  TPA3111D1PWP  IC_TI_TPA3111D1PWP  [TSSOP28_EP]
U9  OPA322SAIDBVT  IC_TI_OPA322SAIDBV  [SOT23-6]

### Nets
3V3_AUD: C180.1 C181.1 C182.1 R206.1 R207.1 U9.6(V+)
+3.3V/1: J49.2 R200.1 R201.1 R205.2 R206.2 ; also sheet 1,2
AGND: C165.2 C166.2 C167.2 C168.2 C169.2 C170.2 C171.2 C172.2 C176.2 C177.1 C179.2 C180.2 C181.2 C182.2 J46.1 J46.3 J46.5 J47.3 J47.4 J48.1 L17.2 Q24.2(S) R202.2 R203.2 R210.2 R211.2 U8.3(GND) U8.4(GND) U8.8(AGND) U8.19(PGND) U8.24(PGND) U8.EP U9.2(V-)
AUD_AMP_FAULT#: R204.1 R205.1 U8.1(!SD) U8.2(!FAULT)
AUD_AMP_G0: R200.2 R202.1 U8.5(GAIN0) ; also sheet 1
AUD_AMP_G1: R201.2 R203.1 U8.6(GAIN1) ; also sheet 1
AUD_AMP_INN: C177.2 U8.11(INN)
AUD_AMP_INP: C174.2 C175.2 U8.12(INP)
AUD_AMP_SD#: R204.2 TP69.1(TP)
AUD_BSN: C178.1 U8.22(BSN) U8.26(BSN)
AUD_BSP: C173.1 U8.17(BSP) U8.21(BSP)
AUD_GVDD: C172.1 U8.9(GVDD) U8.10(PLIMIT)
DGND: L17.1 ; also sheet 1,2,4,5
MIC_AMP_EN: J49.1 Q24.1(G) R210.1 U9.5(!SHDN)
MICROPHONE: J48.2 R207.2 R208.1 U9.3(+IN)
N$52: R199.1 U8.14(AVCC)
N$62: C171.1 R198.1 R199.2 U8.7(AVCC)
N$68: C185.2 R211.1
N$69: C185.1 C186.1 R209.2 U9.4(-IN)
N$70: C183.1 C184.1 C186.2 R209.1 U9.1(OUT)
N$71: Q24.3(D) R208.2
OUTN_UNF: C178.2 L16.2 U8.23(OUTN) U8.25(OUTN)
OUTP_UNF: C173.2 L15.2 U8.18(OUTP) U8.20(OUTP)
P12V: C165.1 C166.1 C167.1 C168.1 C169.1 C170.1 R198.2 U8.15(PVCC) U8.16(PVCC) U8.27(PVCC) U8.28(PVCC) ; also sheet 5
SBC_LINL: C184.2 J47.6
SBC_LINR: C183.2 J47.2
SBC_LOUTL: C175.1 J47.5
SBC_LOUTR: C174.1 J47.1
SPKR1_P: C176.1 J46.2 L15.1
SPKR_N: C179.1 J46.4 L16.1
Unconnected: J47.7 J47.8 J47.9 J47.10 U8.13(NC)

### Notes on the sheet
- Audio Amplifier
- Datasheet shows 100k from pin 7 to pin 14.
  Have asked on the forum for an explanation.
- Tie to ground near source
- NC
- Need to select connector to go to
  LINE IN of SBC.
- Passband gain = 30 dB
- Audio Interfaces
- B
- (C) 2014 eLock Technologies, LLC -- CONFIDENTIAL

## Sheet 7 of 7
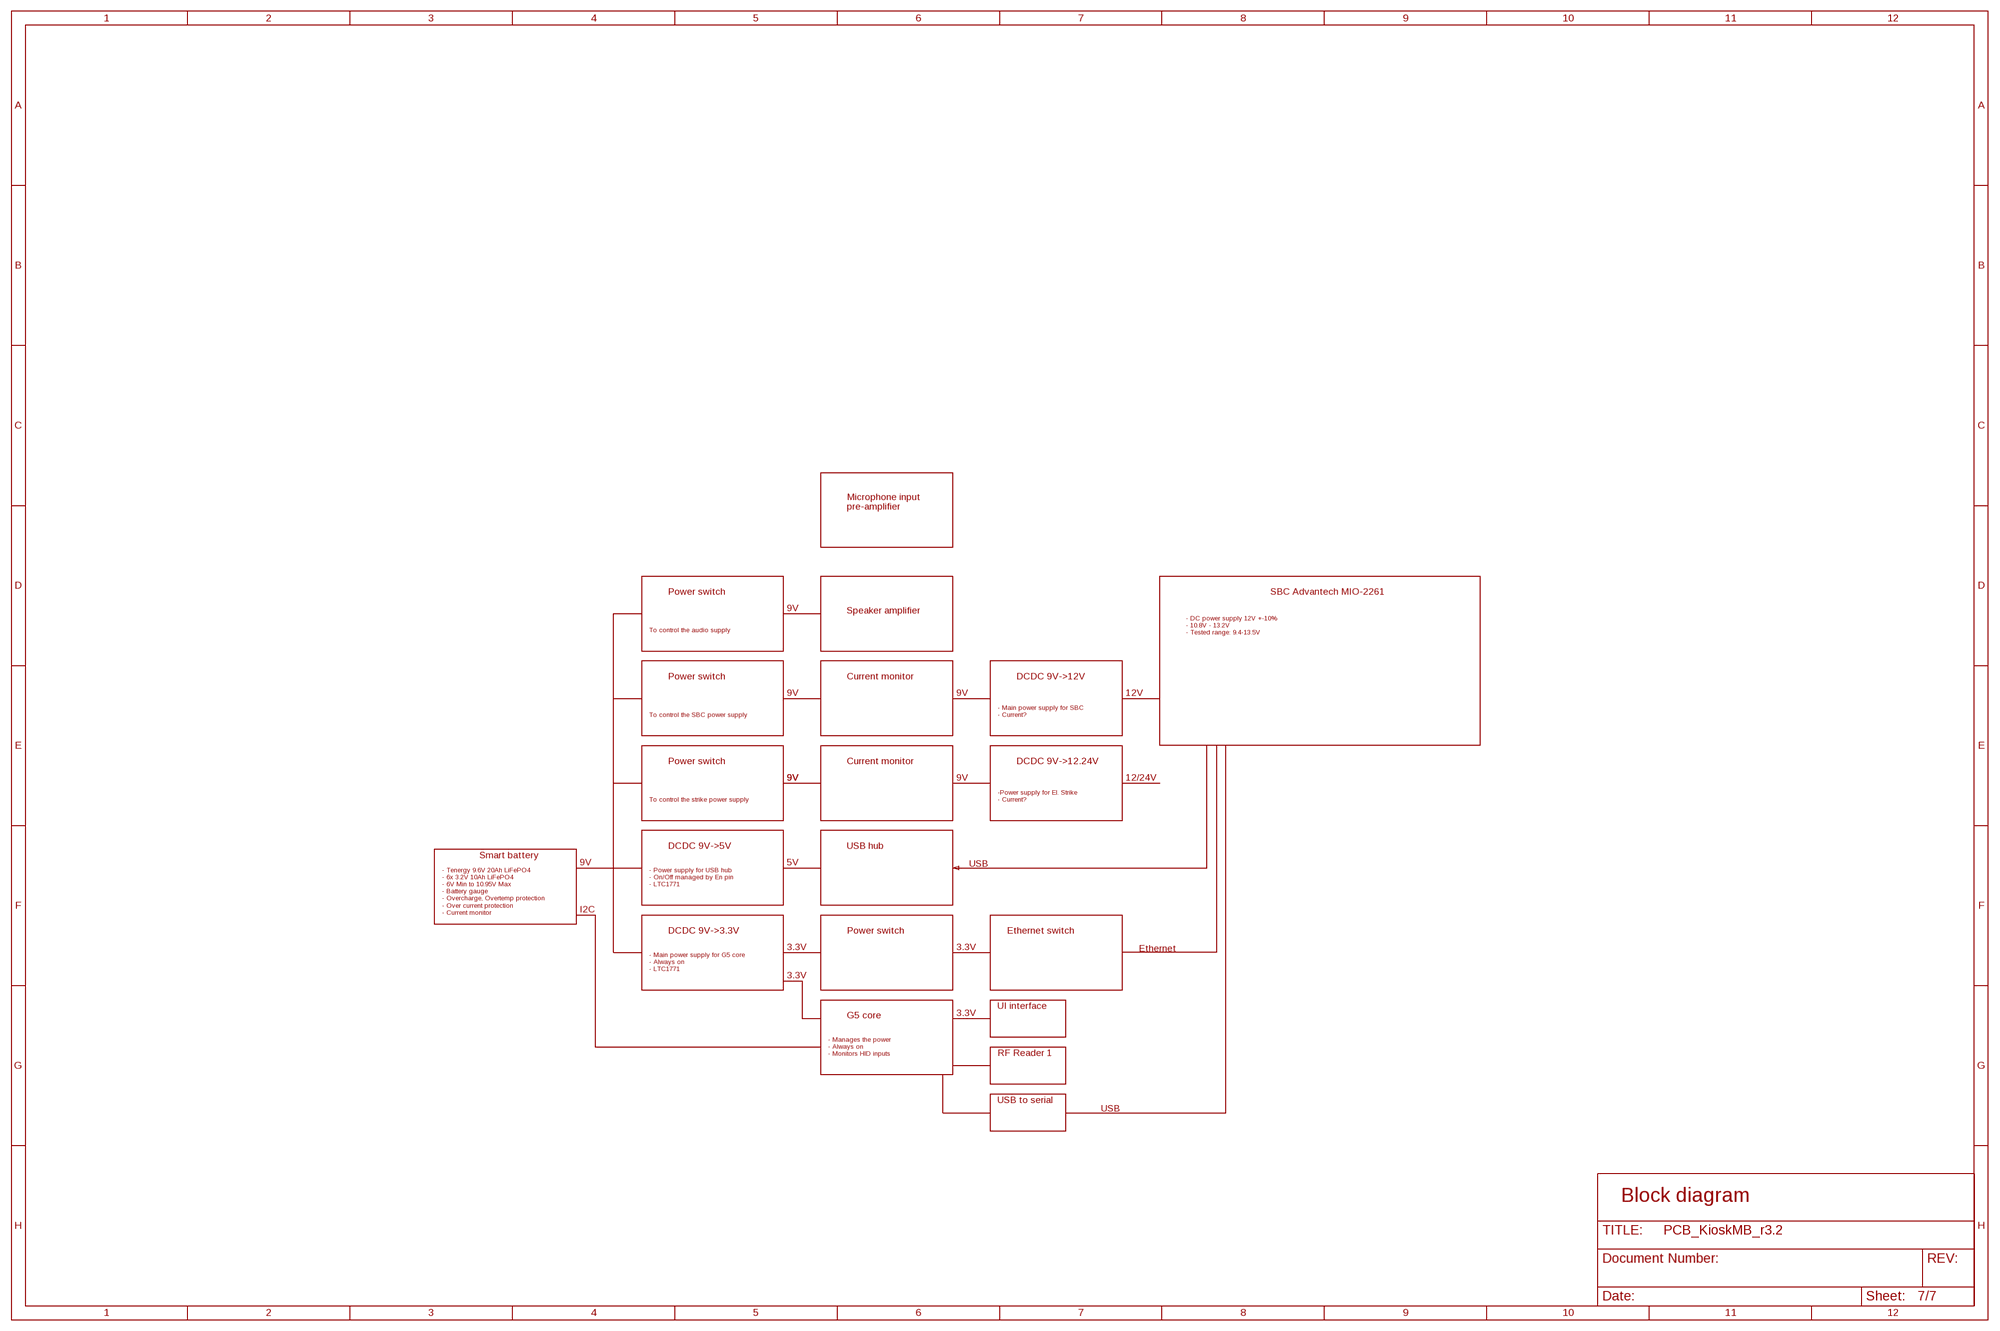
[diagram p10: schematic, sheet 7]

### Notes on the sheet
- Microphone input
  pre-amplifier
- Power switch | SBC Advantech MIO-2261
- 9V | Speaker amplifier
- To control the audio supply
- - DC power supply 12V +-10% 
  - 10.8V - 13.2V
  - Tested range: 9.4-13.5V
- Power switch | Current monitor | DCDC 9V->12V
- 9V | 9V | 12V
- To control the SBC power supply
- - Main power supply for SBC
  - Current?
- Power switch | Current monitor | DCDC 9V->12.24V
- 9V | 9V | 9V | 12/24V
- To control the strike power supply
- -Power supply for El. Strike
  - Current?
- DCDC 9V->5V | USB hub
- Smart battery
- 9V | 5V | USB
- - Power supply for USB hub
  - On/Off managed by En pin
  - LTC1771
- I2C
- - Tenergy 9.6V 20Ah LiFePO4
  - 6x 3.2V 10Ah LiFePO4
  - 6V Min to 10.95V Max
  - Battery gauge
  - Overcharge, Overtemp protection
  - Over current protection
  - Current monitor
- DCDC 9V->3.3V | Power switch | Ethernet switch
- 3.3V | 3.3V | Ethernet
- - Main power supply for G5 core
  - Always on
  - LTC1771
- 3.3V
- UI interface
- G5 core | 3.3V
- - Manages the power
  - Always on
  - Monitors HID inputs
- RF Reader 1
- USB to serial
- USB
- Block diagram

## Library data of the parts
B1 = Keystone:3001: Through hole battery holder, 12mm cell, for BR1216, CR1216, BR1220, CL1220, CR1220, BR1225
C1-C10 C12-C26 C28-C35 C37-C42 C59 C114 C115 C121 C134 C150 C154 C155 C160 C163 C164 C172 = discrete:C-0603
C11 = discrete:C-0805
C27 C45 C46 C149 C152 C153 C157 C158 = discrete:C-1210: Capacitor 1210 3.2x2.5mm
C43 C44 C187 = resistor:CPOL-US: POLARIZED CAPACITOR, American symbol
C122 C123 C128-C130 C136 C137 C180 C181 = Brenneman:C-US-NP: Capacitor, US symbol, non-polarized; MANUFACTURER: Samsung; MFR_PN: CL31A226KAHNNNE
C124 C138 = Brenneman:C-US-NP: Capacitor, US symbol, non-polarized; MANUFACTURER: Samsung; MFR_PN: CL10C101JB8NCNC
C125 C126 C132 C139 C140 C147 = Brenneman:C-US-NP: Capacitor, US symbol, non-polarized; MANUFACTURER: Murata; MFR_PN: GRM188R71H104KA93D
C127 C141 = Brenneman:C-US-NP: Capacitor, US symbol, non-polarized; MANUFACTURER: Samsung; MFR_PN: CL10A475KA8NQNC
C131 = Brenneman:C-US-NP: Capacitor, US symbol, non-polarized; MANUFACTURER: Samsung; MFR_PN: CL10C131JB8NNNC
C133 C174 C175 C177 = Brenneman:C-US-NP: Capacitor, US symbol, non-polarized; MANUFACTURER: Samsung; MFR_PN: CL10B153KB8NNNC
C135 C142 = discrete:C-1206
C143-C145 C171 = Brenneman:C-US-NP: Capacitor, US symbol, non-polarized; MANUFACTURER: Samsung; MFR_PN: CL32B106KBJNNWE
C146 = Brenneman:C-US-NP: Capacitor, US symbol, non-polarized; MANUFACTURER: Samsung; MFR_PN: CL10C101JB8NNNC
C148 = Brenneman:C-US-NP: Capacitor, US symbol, non-polarized; MANUFACTURER: Samsung; MFR_PN: CL10B103KB8NNNC
C156 = discrete:C-POL-3528
C165 C166 = Brenneman:CAP_ELEC_6.3MM_SMD; MANUFACTURER: Kemet; MFR_PN: EEV227M016A9HAA
C167 C168 C182-C186 = Brenneman:C-US-NP: Capacitor, US symbol, non-polarized
C169 C170 C176 C179 = Brenneman:C-US-NP: Capacitor, US symbol, non-polarized; MANUFACTURER: Samsung; MFR_PN: CL10B102KB8NNNC
C173 C178 = Brenneman:C-US-NP: Capacitor, US symbol, non-polarized; MANUFACTURER: Taiyo Yuden; MFR_PN: TMK107B7474KA-TR
CN2 = elock_lib:0039301040: MOLEX 2x2 Connector
D1 = InfineonTech-AON:BAS70-05: Diode Schottky 70mA, 70V
D2 D3 = st-microelectronics-AOM:STPS0540Z: Schottky diode 0.4V@0.5A 40Vrr, low Irr
D4 D20 D22 D30 = NXP-AOM:PMEG3030BEP: DIODE SCHOTTKY 30V 3A SOD128
D17 D19 D23 D24 = discrete:LED-0805
D21 D28 = DiodesInc-AON:SMAJ*: TVS 400W 5.0 Breakdown 6.40-7.25V 6.0 Breakdown 6.67-7.37V
D25 D26 = Vishay-AON:SS1*: Diode schottky If=1A VRR SS12-20 SS13=30 SS14=30 SS15=50 SS16=60
D27 = st-microelectronics-AOM:SMLVT3V3: TVS 600W 4.1 Breakdown
D31 = DiodesInc-AON:BAT54BRW: DIODE SCHOTTKY 0.2A 30V ARR DL 30V SOT363
D32 = Littelfuse:P6SMB*: TVS Unidirectional 13.6V, 15.2-16.8V breakdown
F3 = Littelfuse:1812L014DR: PTC RESETTABLE 60V 140MA 1812L
FID1-FID3 = technol:REF
H1-H6 = SparkFun-Hardware:STANDOFF_ELECTRICAL: Stand Off Drill holes with an electrical connection. For example, use these to ground your board to a chassis. Example SparkFun Products Screw - Phillips Head (1/4", 4-40, 10 pack) <https://www.sparkfun.com/products/10453> (PRT-10453) Screw - Phillips Head (1/2", 4-40, 10 pack) <https://www.sparkfun.com/products/10452> (PRT-10452) Screw - Phillips Head (3/4", 4-40, 10 pack) <https://www.sparkfun.com/products/10451> (PRT-10451) Screw - Phillips Head (1", 4-40, 10 pack) <https://www.sparkfun.com/products/10450> (PRT-10450)
IC1 = Intersil-U:ISL60002: Precision Low power V ref. Iq=350nA Vout=2.5V
IC2 = TexasInstruments-AON:SN65HVD3082E: RS-422/485 TRX 1RX 1TX
IC3 = Microchip-AON:PIC24FJ256GA110: PIC24FJ256GA110 High-Performance, 16-Bit PIC
IC4 = Microchip-AON:PIC10F200T: IC MCU Flash 256B of FLASH
IC5 = NXP-AOM:LM75A: Digital temperature sensor and thermal watchdog - I2C, Pwr supp. 2.8 V to 5.5 V, Temp. range -55°C to +125°C, 11bit ADC, 3.5 µA in shutdown mode
IC6 = Microchip-AON:24*: Serial EEPROM I2C
IC7 = NXP-AOM:PCF2123: RTC chip low power
IC8 = Micron-U:M25P16: 16Mbit low voltage SPI Flash
IC9 = TexasInstruments-AON:LM3405: IC LED DRVR HP CONST TSOT23-6
IC18 = FTD-AON:FT232RL: USB 2.0 to RS232 transfer interface IC
IC19 = Microchip-AON:MCP6022: OPAMP 10MHz Vofset=0.5V
IC21 = LinearTech-AON:LTC1771: Hi efficiency DCDC step down
J1 J47 = CON-Hirose-AON:DF11-10DP-2DSA: CONN HEADER 10POS 2MM PCB GOLD
J2 = CON-pinHeader-AON:MA07-1
J3 = CON-pinHeader-AON:MA13-2
J5 J6 J14 J48 J49 = Tyco-U:3-641215-2: header 2 pin 100mil spacing
J7 J9 = Stewart:SS-6566-NF: AMP CONNECTOR
J8 = CON-pinHeader-AON:MA08-2
J10 = C&K_Components-U:CCM03-3504LFT: CONN SMART CARD FIXED 8PIN SMD
J11 J12 = CON-pinHeader-AON:MA05-1
J13 = TE-Conn-U:3-641215-3: CONN 3 pin header 100mil
J30 = elocktech_lib:HRXL-MAXSONAR-WRC-MB7387
J41 = CON-pinHeader-AON:MA06-1
J43-J45 = Tyco-U:3-641215-4: CONN HEADER VERT 4POS .100 30AU
J46 = TE-Conn-U:3-641215-5: Connector 5 pin 100 mil
JP1-JP5 = ChipTestJig:M02: Standard 2-pin 0.1" header. Use with - straight break away headers ( PRT-00116) - right angle break away headers (PRT-00553) - swiss pins (PRT-00743) - machine pins (PRT-00117) - female headers (PRT-00115) Molex polarized connector foot print use with: PRT-08233 with associated crimp pins and housings. 2.54_SCREWTERM for use with PRT-10571. 3.5mm Screw Terminal footprints for PRT-08084 5mm Screw Terminal footprints for use with PRT-08432
L1 L2 L17 = discrete:L-1206
L3 = Taiyo-Yuden-U:NRS8030: Inductor power 150: 15uH 2.2A
L11 = Brenneman:L: Inductor, two pin; MANUFACTURER: Coilcraft; MFR_PN: SER2013-472ML
L12 = Brenneman:L: Inductor, two pin; MANUFACTURER: Bourns; MFR_PN: SRR1280-1x0M
L14 = Sumida-UT:CR75*: Inductor power, 27uH, 0.12R 1.3A, 33uH, 0.13R 1.2A
L15 L16 = Brenneman:L: Inductor, two pin; MANUFACTURER: Laird; MFR_PN: HI1812V101R-10
Q2 = Fairchild-AON:FDC6330: IC LOAD SWITCH INT 20VIN SSOT-6, 80mOhm, 2.5A
Q3 = Semtech-AOM:SR05: IC TVS ARRAY 2-LINE 5V SOT-143
Q4 = TXC_Tech-U:7B: Crystal 5x3.2mm, 18pF+-30ppm
Q5 = Fairchild-AON:FDC6324: IC LOAD SWITCH INT 20VIN SSOT-6
Q6 = Citizen:CM519
Q7 = Toshiba-AON:SSM6P49: MOSFET P-CH DUAL 30V UDFN6, 4A, 20V
Q14 Q17 = Touchstone-U:TSM9938: IC OPAMP CURRENT SENSE SOT23-5
Q15 Q18 = Vishay-AON:SI4564: MOSFET N/P-CH 40V 10A 8SOIC
Q16 Q19 = Brenneman:TRANS_DUAL_NFET_HALF-BR: Dual n-chan MOSFETs half-bridge config, i.e. TI NexFET; MANUFACTURER: TI; MFR_PN: CSD87331Q3D
Q20 Q21 = InfineonTech-AON:IPD30N06S2L-23: MOSFET-N 55V 30A 0.023ohm
Q23 = Fairchild-AON:FDN352: MOSFET P 30V 1.3A 180mOhm@-10V
Q24 = Brenneman:BSS138: BSS138W N-chan MOSFET
R1 R3-R11 R14 R18 R19 R22 R24 R31-R39 R45-R48 R151 R152 R170 R173 R174 R183 R184 R187 R190 R193-R195 R197 = discrete:R-0603
R2 R20 R21 = Panasonic-AON:EXB-38: Resistor array 4x
R12 R13 R15-R17 R23 R25 R26 = discrete:R-0603-0R
R40-R44 R154 R168 R175 R176 R189 = discrete:R-0805
R156 R159 R167 R186 = Brenneman:R-US_: RESISTOR, American symbol; MANUFACTURER: Panasonic; MFR_PN: ERJ-3GEYJ104V
R157 R158 R171 R172 R198 R199 = Brenneman:R-US_: RESISTOR, American symbol; MANUFACTURER: Rohm; MFR_PN: MCR03ERTJ100
R160 R177 = Brenneman:R-US_: RESISTOR, American symbol; MANUFACTURER: Panasonic; MFR_PN: ERJ-3EKF1783V
R161 R163 R178 R180 = Brenneman:R-US_: RESISTOR, American symbol; MANUFACTURER: Panasonic; MFR_PN: ERJ-3GEY0R00V
R162 R179 = Brenneman:R-US_: RESISTOR, American symbol; MANUFACTURER: Panasonic; MFR_PN: ERJ-3GEYJ103V
R164 = Brenneman:R-US_: RESISTOR, American symbol; MANUFACTURER: Panasonic; MFR_PN: ERJ-3EKF5901V
R165 = Brenneman:R-US_: RESISTOR, American symbol; MANUFACTURER: Panasonic; MFR_PN: ERJ-3EKF9312V
R166 R185 = Brenneman:R-US_: RESISTOR, American symbol; MANUFACTURER: Panasonic; MFR_PN: ERJ-3EKF2002V
R181 R182 = Brenneman:R-US_: RESISTOR, American symbol; MANUFACTURER: Panasonic; MFR_PN: ERJ-3EKFxxxxV
R200-R211 = Brenneman:R-US_: RESISTOR, American symbol
TP1-TP5 TP7-TP9 TP11 TP60 = testpad:ROUND_SMD: Generic round SMD testpad
TP12 = testpad:TP_0812: Testpad hole 0.8mm (32mil)
TP61-TP67 = testpad:TP: Test pad
TP69 = testpad:P1-13
U1 = LinearTech-AON:LTC1955: Dual Smart Card interface with Serial control
U2 = elock_lib:LE33
U3 = SparkFun-AnalogIC:ADS1015: 12-Bit Del-Sig ADC Four single-ended inputs or two differential inputs Internal PGA I2C interface 2.0-5.5V; PROD_ID: IC-12239
U6 U7 = Brenneman:IC_TI_TPS43061: TI TPS43061 boost converter; MANUFACTURER: TI; MFR_PN: TPS43061RTE
U8 = Brenneman:IC_TI_TPA3111D1: TI TPA3111D1 amp; MANUFACTURER: TI; MFR_PN: TPA3111D1PWP
U9 = Brenneman:IC_TI_OPA322S: TI OPA322S opamp with shutdown; MANUFACTURER: TI; MFR_PN: TPA322SAIDBV
X1 = con-hirose:FH12-10S-0.5S: 0.5mm Pitch Connectors For FPC/FFC Source: Data sheet <http://www.hirose.co.jp/cataloge_hp/e58605370.pdf>
X2 = con-cypressindustries:MINI-USB_4P-: MINI USB 4 Pol. Source: www.cypressindustries.com; OC_FARNELL: unknown; OC_NEWARK: unknown